# Altium project PDC.PrjPCB (part 1 of 2)
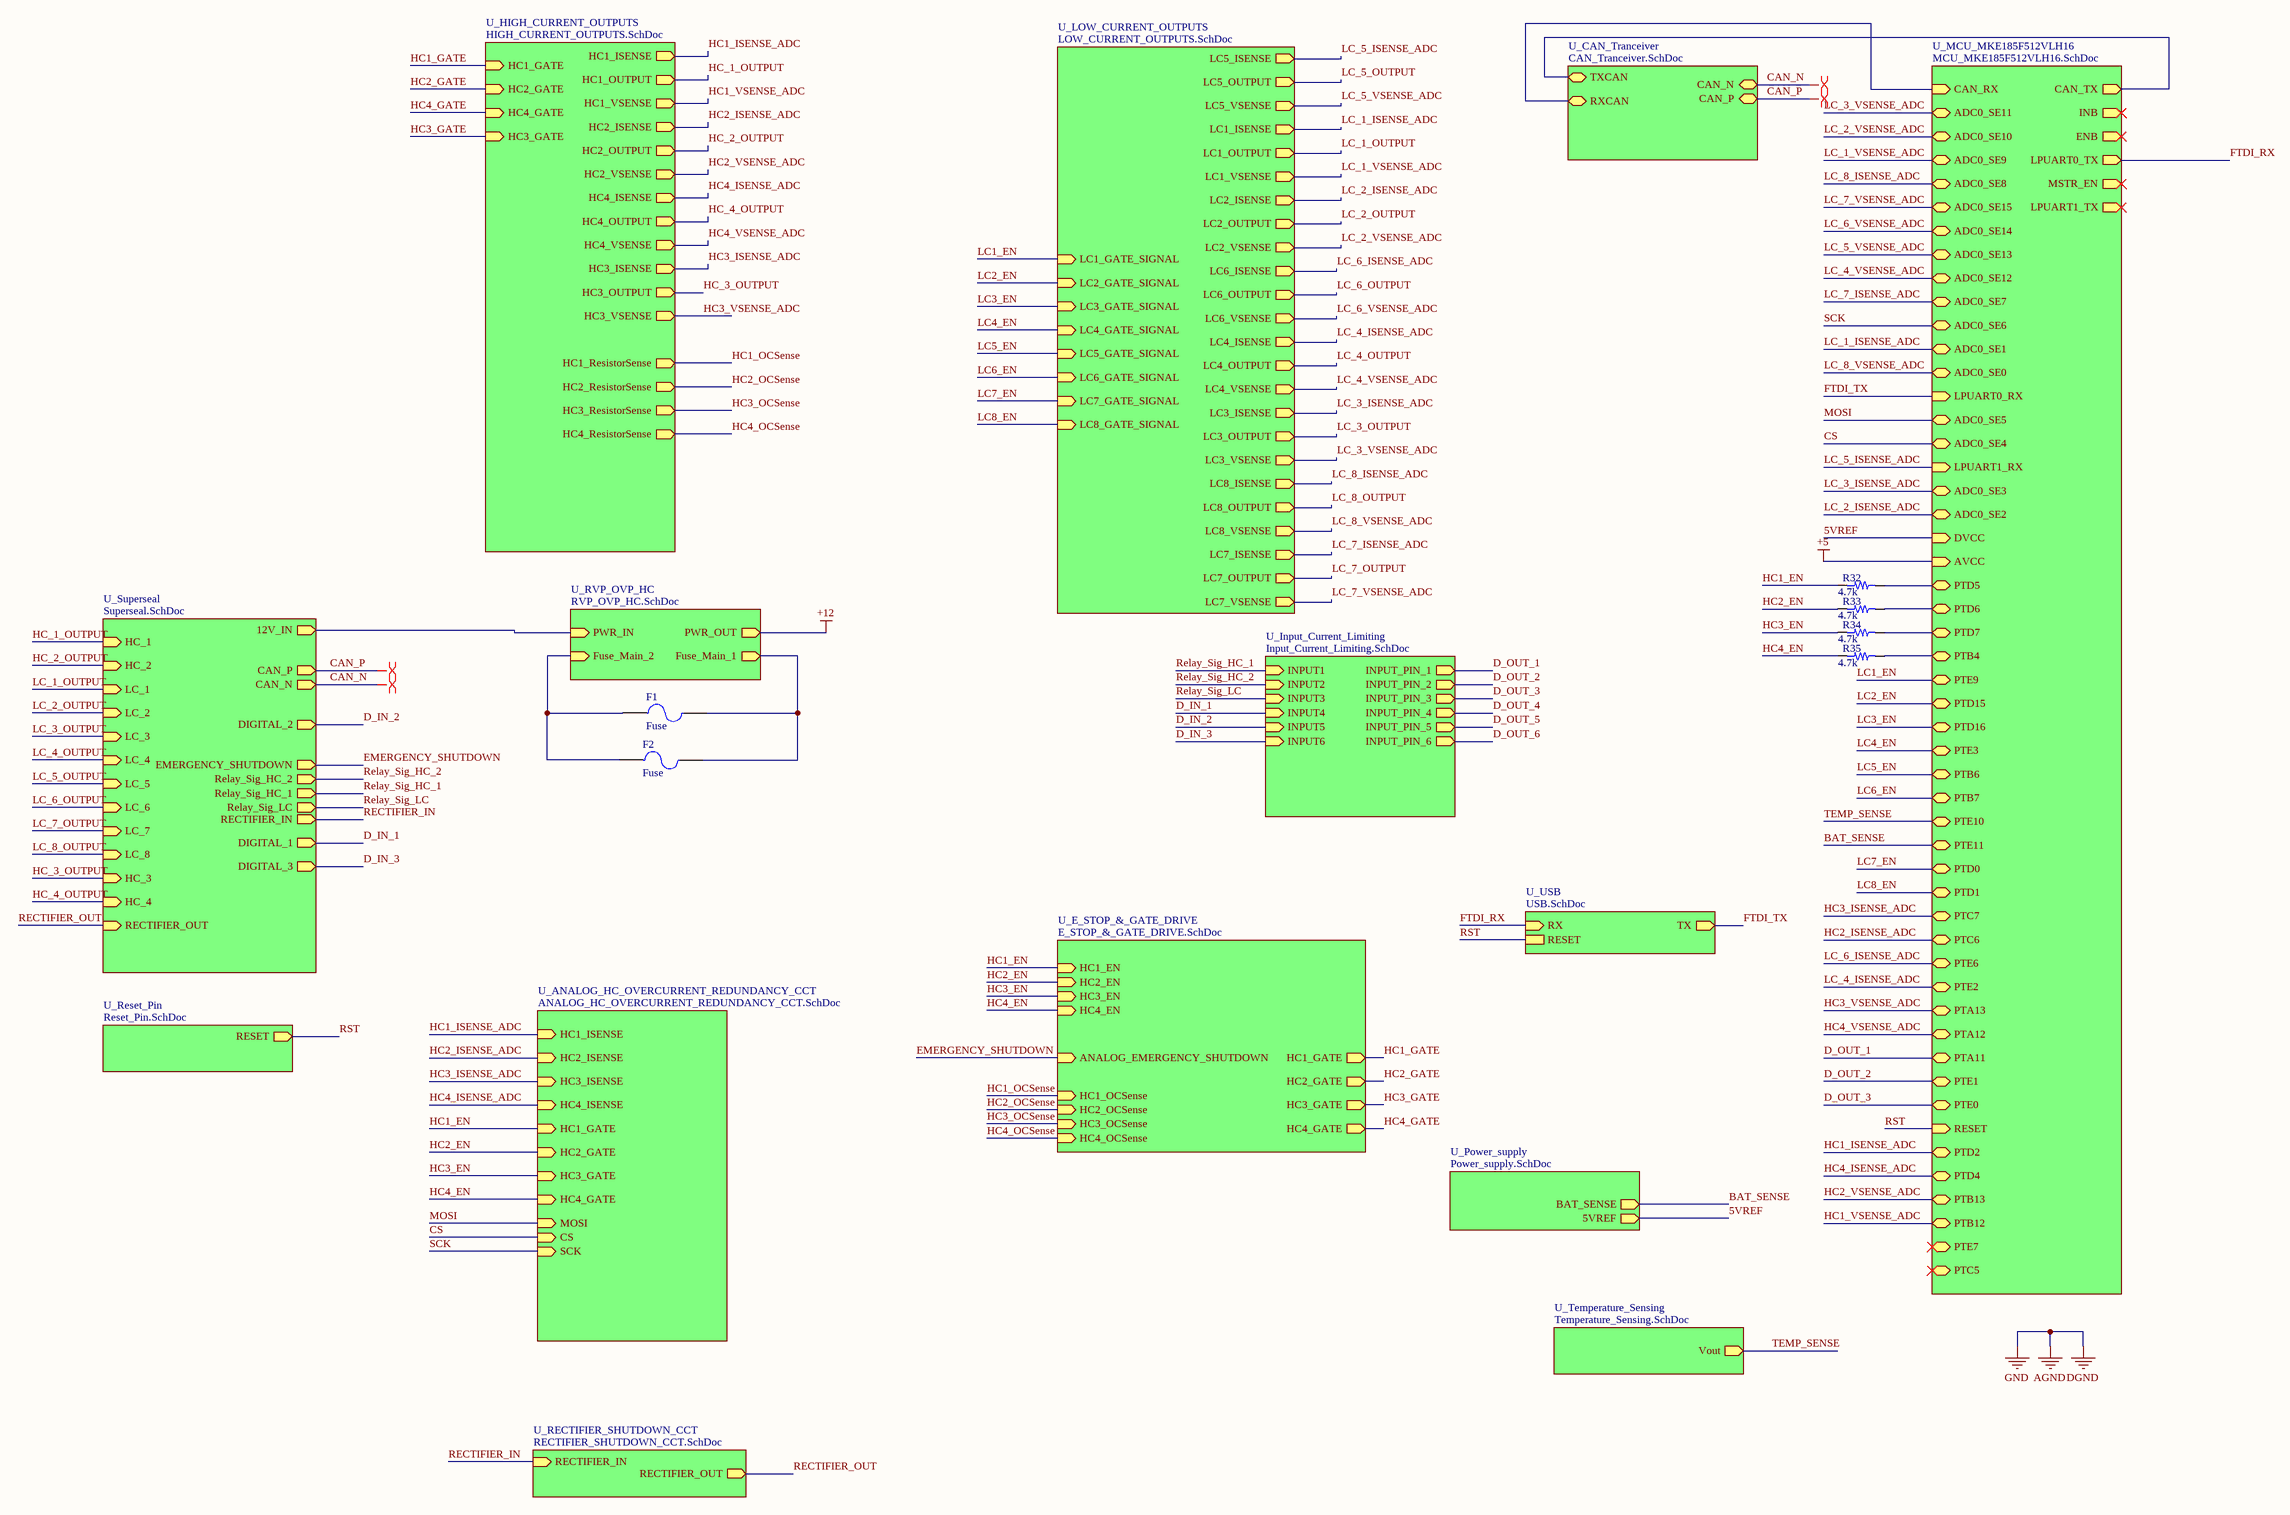
[diagram p0: PDC.SchDoc]
20 sheets, 149 parts. Net scope: hierarchical (ports join the sheet entries above them; power ports are global).
Board file: PDC_Rev2.PcbDoc
Sheets:
  PDC.SchDoc
    U_Superseal = Superseal.SchDoc
    U_LOW_CURRENT_OUTPUTS = LOW_CURRENT_OUTPUTS.SchDoc
      U_PDC_Low_Current_Outputs = PDC_Low_Current_Outputs.SchDoc
      U_PDC_Low_Current_Outputs = PDC_Low_Current_Outputs.SchDoc
      U_PDC_Low_Current_Outputs = PDC_Low_Current_Outputs.SchDoc
      U_PDC_Low_Current_Outputs = PDC_Low_Current_Outputs.SchDoc
      U_PDC_Low_Current_Outputs = PDC_Low_Current_Outputs.SchDoc
      U_PDC_Low_Current_Outputs = PDC_Low_Current_Outputs.SchDoc
      U_PDC_Low_Current_Outputs = PDC_Low_Current_Outputs.SchDoc
      U_PDC_Low_Current_Outputs = PDC_Low_Current_Outputs.SchDoc
      U_PDC_Gate_Driver = PDC_Gate_Driver.SchDoc
      U_PDC_Gate_Driver = PDC_Gate_Driver.SchDoc
    U_E_STOP_&_GATE_DRIVE = E_STOP_&_GATE_DRIVE.SchDoc
      U_Gate_driver = Gate_driver.SchDoc
      U_E_stop = E_stop.SchDoc
    U_Reset_Pin = Reset_Pin.SchDoc
    U_Temperature_Sensing = Temperature_Sensing.SchDoc
    U_RECTIFIER_SHUTDOWN_CCT = RECTIFIER_SHUTDOWN_CCT.SchDoc
      U_Rectifier_shutdown_Gate = Rectifier_shutdown_Gate.SchDoc
      U_Rectifier_shutdown_LT1910 = Rectifier_shutdown_LT1910.SchDoc
    U_HIGH_CURRENT_OUTPUTS = HIGH_CURRENT_OUTPUTS.SchDoc
      U_PDC_high_Current_Outputs = PDC_high_Current_Outputs.SchDoc
      U_PDC_high_Current_Outputs = PDC_high_Current_Outputs.SchDoc
      U_PDC_high_Current_Outputs = PDC_high_Current_Outputs.SchDoc
      U_PDC_high_Current_Outputs = PDC_high_Current_Outputs.SchDoc
    U_ANALOG_HC_OVERCURRENT_REDUNDANCY_CCT = ANALOG_HC_OVERCURRENT_REDUNDANCY_CCT.SchDoc
      U_Analog_HC_Overcurrent_Redundancy = Analog_HC_Overcurrent_Redundancy.SchDoc
      U_Analog_HC_Overcurrent_Redundancy = Analog_HC_Overcurrent_Redundancy.SchDoc
      U_Analog_HC_Overcurrent_Redundancy = Analog_HC_Overcurrent_Redundancy.SchDoc
      U_Analog_HC_Overcurrent_Redundancy = Analog_HC_Overcurrent_Redundancy.SchDoc
      U_Analog_HC_Overcurrent_MMPQ3904 = Analog_HC_Overcurrent_MMPQ3904.SchDoc
    U_Power_supply = Power_supply.SchDoc
    U_Input_Current_Limiting = Input_Current_Limiting.SchDoc

## Sheet PDC.SchDoc
size C

### Parts
F1  Fuse  [3568-MiniFuseHolder]
F2  Fuse  [3568-MiniFuseHolder]
R32  4.7k  [RES 0603/1608]
R33  4.7k  [RES 0603/1608]
R34  4.7k  [RES 0603/1608]
R35  4.7k  [RES 0603/1608]

### Sub-sheets
U_ANALOG_HC_OVERCURRENT_REDUNDANCY_CCT = ANALOG_HC_OVERCURRENT_REDUNDANCY_CCT.SchDoc: HC1_ISENSE (in), HC2_ISENSE (in), HC3_ISENSE (in), HC4_ISENSE (in), HC1_GATE (in), HC2_GATE (in), HC3_GATE (in), HC4_GATE (in), MOSI (in), CS (in), SCK (in)
U_CAN_Tranceiver = CAN_Tranceiver.SchDoc (file not in this document): TXCAN (bidir), RXCAN (bidir), CAN_N (bidir), CAN_P (bidir)
U_E_STOP_&_GATE_DRIVE = E_STOP_&_GATE_DRIVE.SchDoc: HC1_GATE (out), HC2_GATE (out), HC3_GATE (out), HC4_GATE (out), HC1_EN (in), HC4_EN (in), HC3_EN (in), HC2_EN (in), ANALOG_EMERGENCY_SHUTDOWN (in), HC1_OCSense (in), HC2_OCSense (in), HC4_OCSense (in), HC3_OCSense (in)
U_HIGH_CURRENT_OUTPUTS = HIGH_CURRENT_OUTPUTS.SchDoc: HC1_GATE (in), HC1_ISENSE (out), HC1_OUTPUT (out), HC1_VSENSE (out), HC2_GATE (in), HC2_ISENSE (out), HC2_OUTPUT (out), HC2_VSENSE (out), HC4_GATE (in), HC4_ISENSE (out), HC4_OUTPUT (out), HC4_VSENSE (out), HC3_GATE (in), HC3_ISENSE (out), HC3_OUTPUT (out), HC3_VSENSE (out), HC3_ResistorSense (out), HC4_ResistorSense (out), HC2_ResistorSense (out), HC1_ResistorSense (out)
U_Input_Current_Limiting = Input_Current_Limiting.SchDoc: INPUT_PIN_1 (out), INPUT_PIN_2 (out), INPUT1 (in), INPUT2 (in), INPUT_PIN_3 (out), INPUT3 (in), INPUT4 (in), INPUT_PIN_4 (out), INPUT_PIN_5 (out), INPUT5 (in), INPUT6 (in), INPUT_PIN_6 (out)
U_LOW_CURRENT_OUTPUTS = LOW_CURRENT_OUTPUTS.SchDoc: LC5_ISENSE (out), LC5_OUTPUT (out), LC5_VSENSE (out), LC1_ISENSE (out), LC1_OUTPUT (out), LC1_VSENSE (out), LC2_ISENSE (out), LC2_OUTPUT (out), LC2_VSENSE (out), LC6_ISENSE (out), LC6_OUTPUT (out), LC6_VSENSE (out), LC4_ISENSE (out), LC4_OUTPUT (out), LC4_VSENSE (out), LC3_ISENSE (out), LC3_OUTPUT (out), LC3_VSENSE (out), LC8_ISENSE (out), LC8_OUTPUT (out), LC8_VSENSE (out), LC7_ISENSE (out), LC7_OUTPUT (out), LC7_VSENSE (out), LC1_GATE_SIGNAL (in), LC2_GATE_SIGNAL (in), LC3_GATE_SIGNAL (in), LC4_GATE_SIGNAL (in), LC5_GATE_SIGNAL (in), LC6_GATE_SIGNAL (in), LC7_GATE_SIGNAL (in), LC8_GATE_SIGNAL (in)
U_MCU_MKE185F512VLH16 = MCU_MKE185F512VLH16.SchDoc (file not in this document): CAN_TX (out), CAN_RX (in), INB (out), ENB (out), ADC0_SE11 (bidir), ADC0_SE10 (bidir), ADC0_SE9 (bidir), ADC0_SE8 (bidir), ADC0_SE15 (bidir), ADC0_SE14 (bidir), ADC0_SE13 (bidir), ADC0_SE12 (bidir), ADC0_SE7 (bidir), ADC0_SE6 (bidir), ADC0_SE1 (bidir), ADC0_SE0 (bidir), LPUART0_TX (out), LPUART0_RX (in), MSTR_EN (out), ADC0_SE5 (bidir), ADC0_SE4 (bidir), LPUART1_TX (out), LPUART1_RX (in), ADC0_SE3 (bidir), ADC0_SE2 (bidir), DVCC (in), AVCC (in), PTD5 (bidir), PTD6 (bidir), PTD7 (bidir), PTB4 (bidir), PTE9 (bidir), PTD15 (bidir), PTD16 (bidir), PTE3 (bidir), PTB6 (bidir), PTB7 (bidir), PTE10 (bidir), PTE11 (bidir), PTD0 (bidir), PTD1 (bidir), PTC7 (bidir), PTC6 (bidir), PTE6 (bidir), PTE2 (bidir), PTA13 (bidir), PTA12 (bidir), PTA11 (bidir), PTE1 (bidir), PTE0 (bidir), RESET (in), PTD2 (bidir), PTD4 (bidir), PTB13 (bidir), PTB12 (bidir), PTE7 (bidir), PTC5 (bidir)
U_Power_supply = Power_supply.SchDoc: BAT_SENSE (out), 5VREF (out)
U_RECTIFIER_SHUTDOWN_CCT = RECTIFIER_SHUTDOWN_CCT.SchDoc: RECTIFIER_IN (in), RECTIFIER_OUT (out)
U_Reset_Pin = Reset_Pin.SchDoc: RESET (out)
U_RVP_OVP_HC = RVP_OVP_HC.SchDoc (file not in this document): PWR_IN (in), PWR_OUT (out), Fuse_Main_1 (out), Fuse_Main_2 (in)
U_Superseal = Superseal.SchDoc: 12V_IN (out), HC_1 (in), HC_2 (in), LC_1 (in), LC_2 (in), LC_3 (in), LC_4 (in), LC_5 (in), LC_6 (in), LC_7 (in), LC_8 (in), HC_3 (in), HC_4 (in), DIGITAL_2 (out), RECTIFIER_OUT (in), RECTIFIER_IN (out), DIGITAL_1 (out), DIGITAL_3 (out), EMERGENCY_SHUTDOWN (out), Relay_Sig_HC_2 (out), Relay_Sig_HC_1 (out), Relay_Sig_LC (out), CAN_P (out), CAN_N (out)
U_Temperature_Sensing = Temperature_Sensing.SchDoc: Vout (out)
U_USB = USB.SchDoc (file not in this document): TX (out), RX (in), RESET

### Nets
5VREF: sheet U_MCU_MKE185F512VLH16/DVCC, sheet U_Power_supply/5VREF
12V_IN: sheet U_Superseal/12V_IN, sheet U_RVP_OVP_HC/PWR_IN
BAT_SENSE: sheet U_MCU_MKE185F512VLH16/PTE11, sheet U_Power_supply/BAT_SENSE
CAN_N: sheet U_Superseal/CAN_N, sheet U_CAN_Tranceiver/CAN_N
CAN_P: sheet U_Superseal/CAN_P, sheet U_CAN_Tranceiver/CAN_P
CS: sheet U_MCU_MKE185F512VLH16/ADC0_SE4, sheet U_ANALOG_HC_OVERCURRENT_REDUNDANCY_CCT/CS
D_IN_1: sheet U_Superseal/DIGITAL_1, sheet U_Input_Current_Limiting/INPUT4
D_IN_2: sheet U_Superseal/DIGITAL_2, sheet U_Input_Current_Limiting/INPUT5
D_IN_3: sheet U_Superseal/DIGITAL_3, sheet U_Input_Current_Limiting/INPUT6
D_OUT_1: sheet U_MCU_MKE185F512VLH16/PTA11, sheet U_Input_Current_Limiting/INPUT_PIN_1
D_OUT_2: sheet U_MCU_MKE185F512VLH16/PTE1, sheet U_Input_Current_Limiting/INPUT_PIN_2
D_OUT_3: sheet U_MCU_MKE185F512VLH16/PTE0, sheet U_Input_Current_Limiting/INPUT_PIN_3
EMERGENCY_SHUTDOWN: sheet U_Superseal/EMERGENCY_SHUTDOWN, sheet U_E_STOP_&_GATE_DRIVE/ANALOG_EMERGENCY_SHUTDOWN
FTDI_RX: sheet U_MCU_MKE185F512VLH16/LPUART0_TX, sheet U_USB/RX
FTDI_TX: sheet U_MCU_MKE185F512VLH16/LPUART0_RX, sheet U_USB/TX
HC1_EN: R32.1 ; sheet U_E_STOP_&_GATE_DRIVE/HC1_EN, sheet U_ANALOG_HC_OVERCURRENT_REDUNDANCY_CCT/HC1_GATE
HC1_GATE: sheet U_E_STOP_&_GATE_DRIVE/HC1_GATE, sheet U_HIGH_CURRENT_OUTPUTS/HC1_GATE
HC1_ISENSE_ADC: sheet U_MCU_MKE185F512VLH16/PTD2, sheet U_HIGH_CURRENT_OUTPUTS/HC1_ISENSE, sheet U_ANALOG_HC_OVERCURRENT_REDUNDANCY_CCT/HC1_ISENSE
HC1_OCSense: sheet U_E_STOP_&_GATE_DRIVE/HC1_OCSense, sheet U_HIGH_CURRENT_OUTPUTS/HC1_ResistorSense
HC1_VSENSE_ADC: sheet U_MCU_MKE185F512VLH16/PTB12, sheet U_HIGH_CURRENT_OUTPUTS/HC1_VSENSE
HC2_EN: R33.1 ; sheet U_E_STOP_&_GATE_DRIVE/HC2_EN, sheet U_ANALOG_HC_OVERCURRENT_REDUNDANCY_CCT/HC2_GATE
HC2_GATE: sheet U_E_STOP_&_GATE_DRIVE/HC2_GATE, sheet U_HIGH_CURRENT_OUTPUTS/HC2_GATE
HC2_ISENSE_ADC: sheet U_MCU_MKE185F512VLH16/PTC6, sheet U_HIGH_CURRENT_OUTPUTS/HC2_ISENSE, sheet U_ANALOG_HC_OVERCURRENT_REDUNDANCY_CCT/HC2_ISENSE
HC2_OCSense: sheet U_E_STOP_&_GATE_DRIVE/HC2_OCSense, sheet U_HIGH_CURRENT_OUTPUTS/HC2_ResistorSense
HC2_VSENSE_ADC: sheet U_MCU_MKE185F512VLH16/PTB13, sheet U_HIGH_CURRENT_OUTPUTS/HC2_VSENSE
HC3_EN: R34.1 ; sheet U_E_STOP_&_GATE_DRIVE/HC3_EN, sheet U_ANALOG_HC_OVERCURRENT_REDUNDANCY_CCT/HC3_GATE
HC3_GATE: sheet U_E_STOP_&_GATE_DRIVE/HC3_GATE, sheet U_HIGH_CURRENT_OUTPUTS/HC3_GATE
HC3_ISENSE_ADC: sheet U_MCU_MKE185F512VLH16/PTC7, sheet U_HIGH_CURRENT_OUTPUTS/HC3_ISENSE, sheet U_ANALOG_HC_OVERCURRENT_REDUNDANCY_CCT/HC3_ISENSE
HC3_OCSense: sheet U_E_STOP_&_GATE_DRIVE/HC3_OCSense, sheet U_HIGH_CURRENT_OUTPUTS/HC3_ResistorSense
HC3_VSENSE_ADC: sheet U_MCU_MKE185F512VLH16/PTA13, sheet U_HIGH_CURRENT_OUTPUTS/HC3_VSENSE
HC4_EN: R35.1 ; sheet U_E_STOP_&_GATE_DRIVE/HC4_EN, sheet U_ANALOG_HC_OVERCURRENT_REDUNDANCY_CCT/HC4_GATE
HC4_GATE: sheet U_E_STOP_&_GATE_DRIVE/HC4_GATE, sheet U_HIGH_CURRENT_OUTPUTS/HC4_GATE
HC4_ISENSE_ADC: sheet U_MCU_MKE185F512VLH16/PTD4, sheet U_HIGH_CURRENT_OUTPUTS/HC4_ISENSE, sheet U_ANALOG_HC_OVERCURRENT_REDUNDANCY_CCT/HC4_ISENSE
HC4_OCSense: sheet U_E_STOP_&_GATE_DRIVE/HC4_OCSense, sheet U_HIGH_CURRENT_OUTPUTS/HC4_ResistorSense
HC4_VSENSE_ADC: sheet U_MCU_MKE185F512VLH16/PTA12, sheet U_HIGH_CURRENT_OUTPUTS/HC4_VSENSE
HC_1_OUTPUT: sheet U_Superseal/HC_1, sheet U_HIGH_CURRENT_OUTPUTS/HC1_OUTPUT
HC_2_OUTPUT: sheet U_Superseal/HC_2, sheet U_HIGH_CURRENT_OUTPUTS/HC2_OUTPUT
HC_3_OUTPUT: sheet U_Superseal/HC_3, sheet U_HIGH_CURRENT_OUTPUTS/HC3_OUTPUT
HC_4_OUTPUT: sheet U_Superseal/HC_4, sheet U_HIGH_CURRENT_OUTPUTS/HC4_OUTPUT
LC1_EN: sheet U_LOW_CURRENT_OUTPUTS/LC1_GATE_SIGNAL, sheet U_MCU_MKE185F512VLH16/PTE9
LC2_EN: sheet U_LOW_CURRENT_OUTPUTS/LC2_GATE_SIGNAL, sheet U_MCU_MKE185F512VLH16/PTD15
LC3_EN: sheet U_LOW_CURRENT_OUTPUTS/LC3_GATE_SIGNAL, sheet U_MCU_MKE185F512VLH16/PTD16
LC4_EN: sheet U_LOW_CURRENT_OUTPUTS/LC4_GATE_SIGNAL, sheet U_MCU_MKE185F512VLH16/PTE3
LC5_EN: sheet U_LOW_CURRENT_OUTPUTS/LC5_GATE_SIGNAL, sheet U_MCU_MKE185F512VLH16/PTB6
LC6_EN: sheet U_LOW_CURRENT_OUTPUTS/LC6_GATE_SIGNAL, sheet U_MCU_MKE185F512VLH16/PTB7
LC7_EN: sheet U_LOW_CURRENT_OUTPUTS/LC7_GATE_SIGNAL, sheet U_MCU_MKE185F512VLH16/PTD0
LC8_EN: sheet U_LOW_CURRENT_OUTPUTS/LC8_GATE_SIGNAL, sheet U_MCU_MKE185F512VLH16/PTD1
LC_1_ISENSE_ADC: sheet U_LOW_CURRENT_OUTPUTS/LC1_ISENSE, sheet U_MCU_MKE185F512VLH16/ADC0_SE1
LC_1_OUTPUT: sheet U_Superseal/LC_1, sheet U_LOW_CURRENT_OUTPUTS/LC1_OUTPUT
LC_1_VSENSE_ADC: sheet U_LOW_CURRENT_OUTPUTS/LC1_VSENSE, sheet U_MCU_MKE185F512VLH16/ADC0_SE9
LC_2_ISENSE_ADC: sheet U_LOW_CURRENT_OUTPUTS/LC2_ISENSE, sheet U_MCU_MKE185F512VLH16/ADC0_SE2
LC_2_OUTPUT: sheet U_Superseal/LC_2, sheet U_LOW_CURRENT_OUTPUTS/LC2_OUTPUT
LC_2_VSENSE_ADC: sheet U_LOW_CURRENT_OUTPUTS/LC2_VSENSE, sheet U_MCU_MKE185F512VLH16/ADC0_SE10
LC_3_ISENSE_ADC: sheet U_LOW_CURRENT_OUTPUTS/LC3_ISENSE, sheet U_MCU_MKE185F512VLH16/ADC0_SE3
LC_3_OUTPUT: sheet U_Superseal/LC_3, sheet U_LOW_CURRENT_OUTPUTS/LC3_OUTPUT
LC_3_VSENSE_ADC: sheet U_LOW_CURRENT_OUTPUTS/LC3_VSENSE, sheet U_MCU_MKE185F512VLH16/ADC0_SE11
LC_4_ISENSE_ADC: sheet U_LOW_CURRENT_OUTPUTS/LC4_ISENSE, sheet U_MCU_MKE185F512VLH16/PTE2
LC_4_OUTPUT: sheet U_Superseal/LC_4, sheet U_LOW_CURRENT_OUTPUTS/LC4_OUTPUT
LC_4_VSENSE_ADC: sheet U_LOW_CURRENT_OUTPUTS/LC4_VSENSE, sheet U_MCU_MKE185F512VLH16/ADC0_SE12
LC_5_ISENSE_ADC: sheet U_LOW_CURRENT_OUTPUTS/LC5_ISENSE, sheet U_MCU_MKE185F512VLH16/LPUART1_RX
LC_5_OUTPUT: sheet U_Superseal/LC_5, sheet U_LOW_CURRENT_OUTPUTS/LC5_OUTPUT
LC_5_VSENSE_ADC: sheet U_LOW_CURRENT_OUTPUTS/LC5_VSENSE, sheet U_MCU_MKE185F512VLH16/ADC0_SE13
LC_6_ISENSE_ADC: sheet U_LOW_CURRENT_OUTPUTS/LC6_ISENSE, sheet U_MCU_MKE185F512VLH16/PTE6
LC_6_OUTPUT: sheet U_Superseal/LC_6, sheet U_LOW_CURRENT_OUTPUTS/LC6_OUTPUT
LC_6_VSENSE_ADC: sheet U_LOW_CURRENT_OUTPUTS/LC6_VSENSE, sheet U_MCU_MKE185F512VLH16/ADC0_SE14
LC_7_ISENSE_ADC: sheet U_LOW_CURRENT_OUTPUTS/LC7_ISENSE, sheet U_MCU_MKE185F512VLH16/ADC0_SE7
LC_7_OUTPUT: sheet U_Superseal/LC_7, sheet U_LOW_CURRENT_OUTPUTS/LC7_OUTPUT
LC_7_VSENSE_ADC: sheet U_LOW_CURRENT_OUTPUTS/LC7_VSENSE, sheet U_MCU_MKE185F512VLH16/ADC0_SE15
LC_8_ISENSE_ADC: sheet U_LOW_CURRENT_OUTPUTS/LC8_ISENSE, sheet U_MCU_MKE185F512VLH16/ADC0_SE8
LC_8_OUTPUT: sheet U_Superseal/LC_8, sheet U_LOW_CURRENT_OUTPUTS/LC8_OUTPUT
LC_8_VSENSE_ADC: sheet U_LOW_CURRENT_OUTPUTS/LC8_VSENSE, sheet U_MCU_MKE185F512VLH16/ADC0_SE0
MOSI: sheet U_MCU_MKE185F512VLH16/ADC0_SE5, sheet U_ANALOG_HC_OVERCURRENT_REDUNDANCY_CCT/MOSI
RECTIFIER_IN: sheet U_Superseal/RECTIFIER_IN, sheet U_RECTIFIER_SHUTDOWN_CCT/RECTIFIER_IN
RECTIFIER_OUT: sheet U_Superseal/RECTIFIER_OUT, sheet U_RECTIFIER_SHUTDOWN_CCT/RECTIFIER_OUT
Relay_Sig_HC_1: sheet U_Superseal/Relay_Sig_HC_1, sheet U_Input_Current_Limiting/INPUT1
Relay_Sig_HC_2: sheet U_Superseal/Relay_Sig_HC_2, sheet U_Input_Current_Limiting/INPUT2
Relay_Sig_LC: sheet U_Superseal/Relay_Sig_LC, sheet U_Input_Current_Limiting/INPUT3
RST: sheet U_Reset_Pin/RESET, sheet U_MCU_MKE185F512VLH16/RESET, sheet U_USB/RESET
SCK: sheet U_MCU_MKE185F512VLH16/ADC0_SE6, sheet U_ANALOG_HC_OVERCURRENT_REDUNDANCY_CCT/SCK
TEMP_SENSE: sheet U_Temperature_Sensing/Vout, sheet U_MCU_MKE185F512VLH16/PTE10
NetF1_1: F1.1 F2.1 ; sheet U_RVP_OVP_HC/Fuse_Main_2
NetF1_2: F1.2 F2.2 ; sheet U_RVP_OVP_HC/Fuse_Main_1
NetR32_2: R32.2 ; sheet U_MCU_MKE185F512VLH16/PTD5
NetR33_2: R33.2 ; sheet U_MCU_MKE185F512VLH16/PTD6
NetR34_2: R34.2 ; sheet U_MCU_MKE185F512VLH16/PTD7
NetR35_2: R35.2 ; sheet U_MCU_MKE185F512VLH16/PTB4
(unnamed): sheet U_CAN_Tranceiver/TXCAN, sheet U_MCU_MKE185F512VLH16/CAN_TX
(unnamed): sheet U_CAN_Tranceiver/RXCAN, sheet U_MCU_MKE185F512VLH16/CAN_RX

### Layout directives
differential pair: CAN_N, CAN_P

### Library data of the parts
F1 F2 = 3: Manufacturer_id: 1; idFuse: 3; Name: 3568 Mini Fuse Holder; Drawer_id: 1
R32-R35 = 1: id: 1; name: 0603 Resistor; percent tolerance: 5; resistance: 4.7k; package: 0603; quantity: 0

## Sheet Superseal.SchDoc
size A
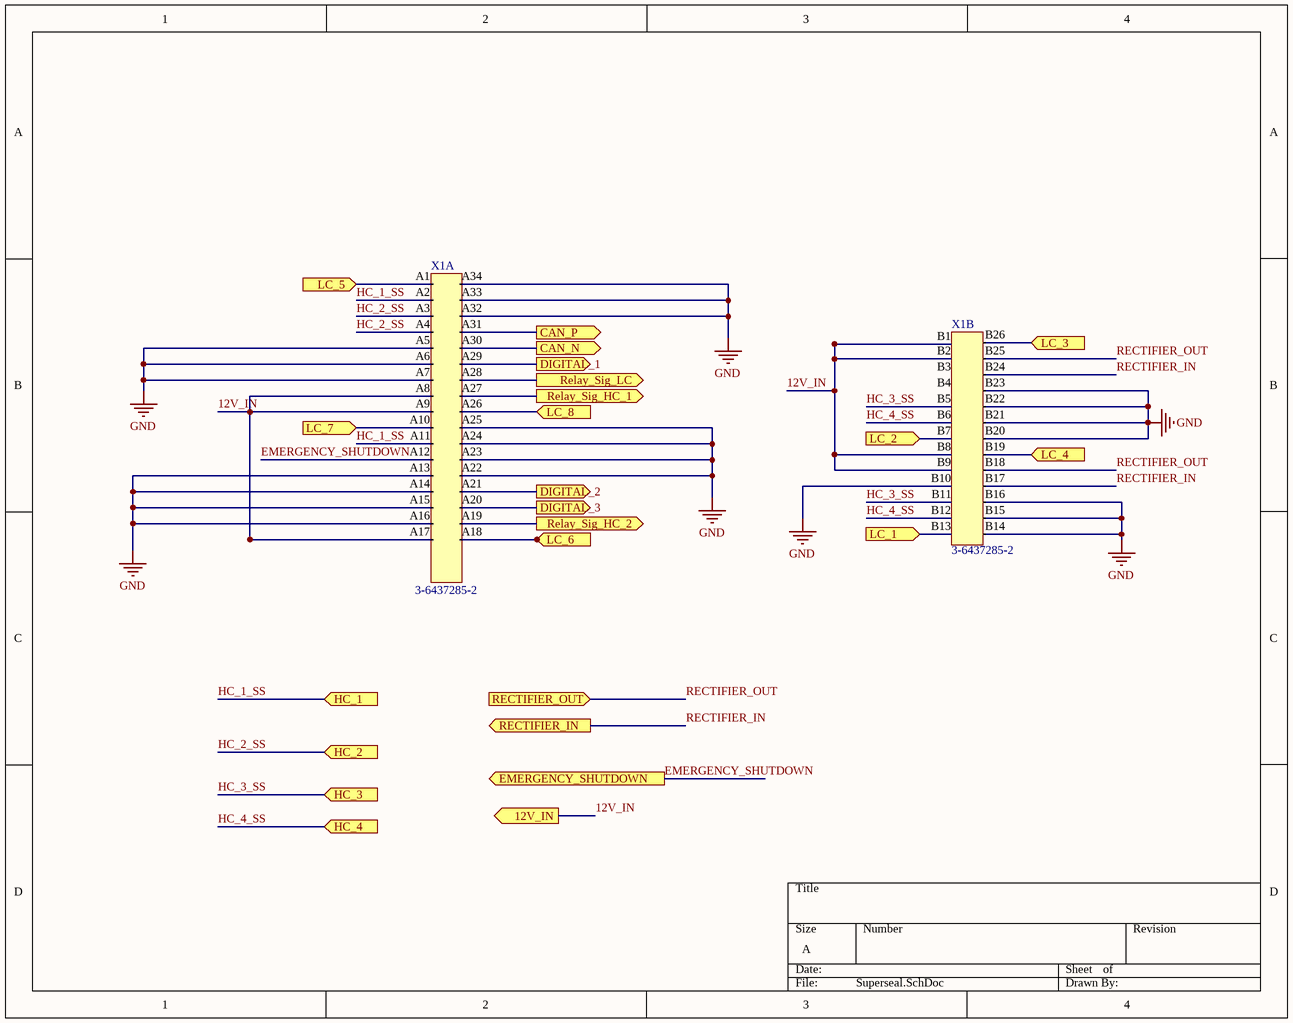
[diagram p1: Superseal.SchDoc]

### Parts
X1  3-6437285-2  [SUPERSEAL 60POS 90Deg]  (parts A,B of 2)

### Ports
12V_IN (out), CAN_N (out), CAN_P (out), DIGITAL_1 (out), DIGITAL_2 (out), DIGITAL_3 (out), EMERGENCY_SHUTDOWN (out), HC_1 (in), HC_2 (in), HC_3 (in), HC_4 (in), LC_1 (in), LC_2 (in), LC_3 (in), LC_4 (in), LC_5 (in), LC_6 (in), LC_7 (in), LC_8 (in), RECTIFIER_IN (out), RECTIFIER_OUT (in), Relay_Sig_HC_1 (out), Relay_Sig_HC_2 (out), Relay_Sig_LC (out)

### Nets
GND: X1.A5 X1.A6 X1.A7 X1.A13 X1.A14 X1.A15 X1.A16 X1.A22 X1.A23 X1.A24 X1.A25 X1.A32 X1.A33 X1.A34 X1.B10 X1.B14 X1.B15 X1.B16 X1.B20 X1.B21 X1.B22 X1.B23  [project net AGND]
12V_IN: X1.A8 X1.A9 X1.A17 X1.B1 X1.B2 X1.B8 X1.B9 ; port 12V_IN
CAN_N: X1.A30 ; port CAN_N
CAN_P: X1.A31 ; port CAN_P
D_IN_1: X1.A29 ; port DIGITAL_1
D_IN_2: X1.A21 ; port DIGITAL_2
D_IN_3: X1.A20 ; port DIGITAL_3
EMERGENCY_SHUTDOWN: X1.A12 ; port EMERGENCY_SHUTDOWN
HC_1_SS: X1.A2 X1.A11 ; port HC_1  [project net HC_1_OUTPUT]
HC_2_SS: X1.A3 X1.A4 ; port HC_2  [project net HC_2_OUTPUT]
HC_3_SS: X1.B5 X1.B11 ; port HC_3  [project net HC_3_OUTPUT]
HC_4_SS: X1.B6 X1.B12 ; port HC_4  [project net HC_4_OUTPUT]
LC_1_OUTPUT: X1.B13 ; port LC_1
LC_2_OUTPUT: X1.B7 ; port LC_2
LC_3_OUTPUT: X1.B26 ; port LC_3
LC_4_OUTPUT: X1.B19 ; port LC_4
LC_5_OUTPUT: X1.A1 ; port LC_5
LC_6_OUTPUT: X1.A18 ; port LC_6
LC_7_OUTPUT: X1.A10 ; port LC_7
LC_8_OUTPUT: X1.A26 ; port LC_8
RECTIFIER_IN: X1.B17 X1.B24 ; port RECTIFIER_IN
RECTIFIER_OUT: X1.B18 X1.B25 ; port RECTIFIER_OUT
Relay_Sig_HC_1: X1.A27 ; port Relay_Sig_HC_1
Relay_Sig_HC_2: X1.A19 ; port Relay_Sig_HC_2
Relay_Sig_LC: X1.A28 ; port Relay_Sig_LC

Not connected (* = marked no-connect by the designer): X1 B3 B4

### Library data of the parts
X1 = 3: 90 Degree; Manufacturer_id: 1; idConn: 3; Name: AMP Superseal 60POS 90Deg; Value: CONN; Num_Contacts: 60; Num_Rows: 4; Pitch: 3 mm; MfrPartNo: 3-6437285-2; Drawer_id: 1; Link: https://www.te.com/usa-en/product-3-6437285-2.html; ComponentLink1Description: Datasheet

## Sheet LOW_CURRENT_OUTPUTS.SchDoc
size A
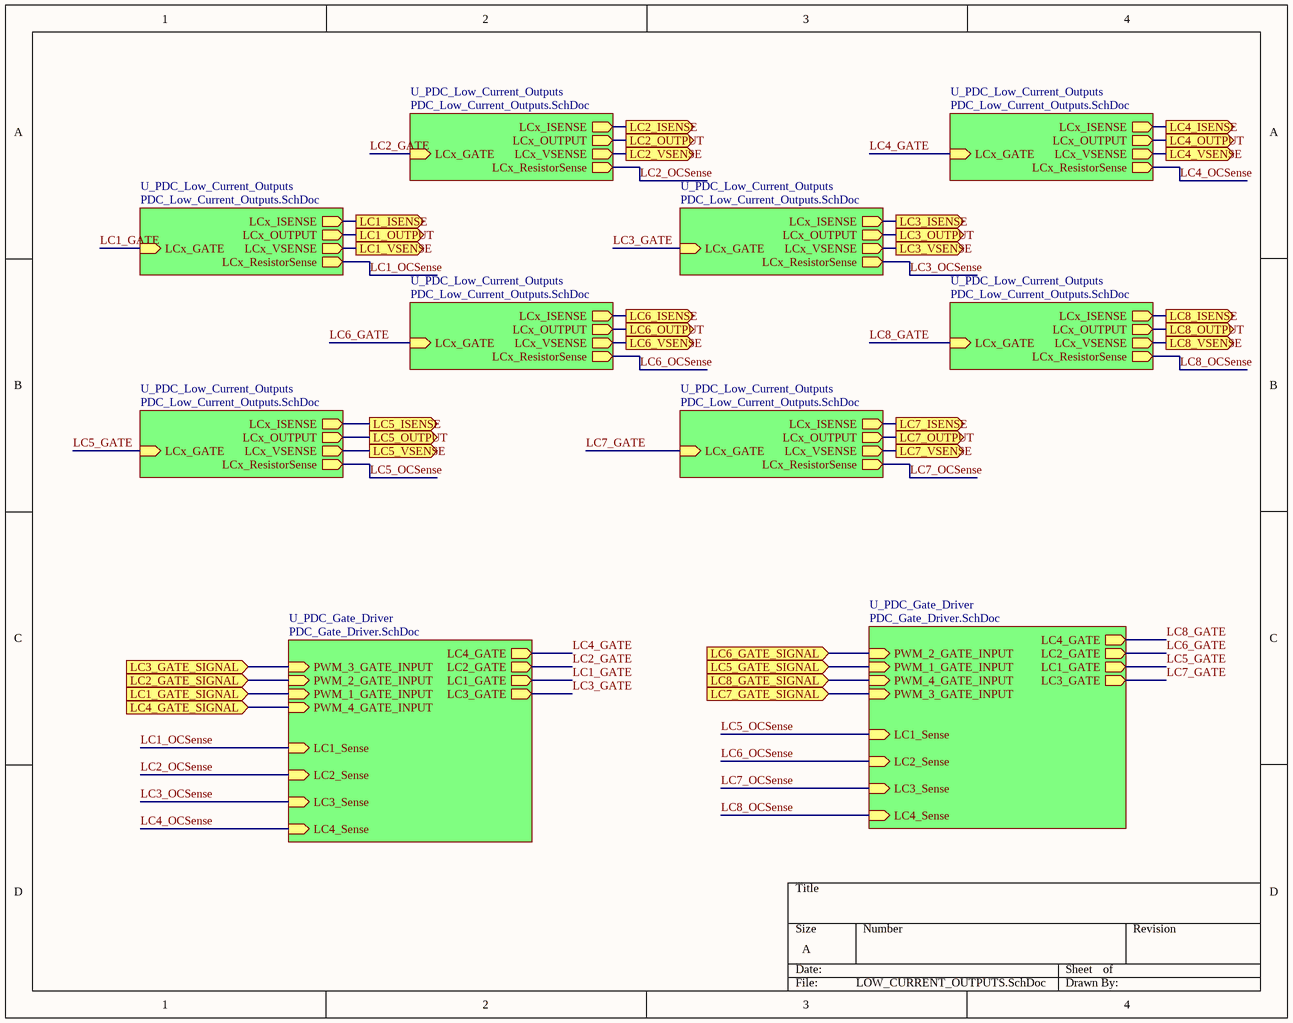
[diagram p2: LOW_CURRENT_OUTPUTS.SchDoc]

### Sub-sheets
U_PDC_Gate_Driver = PDC_Gate_Driver.SchDoc: LC4_GATE (out), LC2_GATE (out), LC1_GATE (out), LC3_GATE (out), PWM_3_GATE_INPUT (in), PWM_2_GATE_INPUT (in), PWM_1_GATE_INPUT (in), PWM_4_GATE_INPUT (in), LC4_Sense (in), LC2_Sense (in), LC1_Sense (in), LC3_Sense (in)
U_PDC_Gate_Driver = PDC_Gate_Driver.SchDoc: LC4_GATE (out), LC2_GATE (out), LC1_GATE (out), LC3_GATE (out), PWM_2_GATE_INPUT (in), PWM_1_GATE_INPUT (in), PWM_4_GATE_INPUT (in), PWM_3_GATE_INPUT (in), LC4_Sense (in), LC2_Sense (in), LC1_Sense (in), LC3_Sense (in)
U_PDC_Low_Current_Outputs = PDC_Low_Current_Outputs.SchDoc: LCx_ISENSE (out), LCx_OUTPUT (out), LCx_VSENSE (out), LCx_GATE (in), LCx_ResistorSense (out)
U_PDC_Low_Current_Outputs = PDC_Low_Current_Outputs.SchDoc: LCx_ISENSE (out), LCx_OUTPUT (out), LCx_VSENSE (out), LCx_GATE (in), LCx_ResistorSense (out)
U_PDC_Low_Current_Outputs = PDC_Low_Current_Outputs.SchDoc: LCx_ISENSE (out), LCx_OUTPUT (out), LCx_VSENSE (out), LCx_GATE (in), LCx_ResistorSense (out)
U_PDC_Low_Current_Outputs = PDC_Low_Current_Outputs.SchDoc: LCx_ISENSE (out), LCx_OUTPUT (out), LCx_VSENSE (out), LCx_GATE (in), LCx_ResistorSense (out)
U_PDC_Low_Current_Outputs = PDC_Low_Current_Outputs.SchDoc: LCx_ISENSE (out), LCx_OUTPUT (out), LCx_VSENSE (out), LCx_GATE (in), LCx_ResistorSense (out)
U_PDC_Low_Current_Outputs = PDC_Low_Current_Outputs.SchDoc: LCx_ISENSE (out), LCx_OUTPUT (out), LCx_VSENSE (out), LCx_GATE (in), LCx_ResistorSense (out)
U_PDC_Low_Current_Outputs = PDC_Low_Current_Outputs.SchDoc: LCx_ISENSE (out), LCx_OUTPUT (out), LCx_VSENSE (out), LCx_GATE (in), LCx_ResistorSense (out)
U_PDC_Low_Current_Outputs = PDC_Low_Current_Outputs.SchDoc: LCx_ISENSE (out), LCx_OUTPUT (out), LCx_VSENSE (out), LCx_GATE (in), LCx_ResistorSense (out)

### Ports
LC1_GATE_SIGNAL (in), LC1_ISENSE (out), LC1_OUTPUT (out), LC1_VSENSE (out), LC2_GATE_SIGNAL (in), LC2_ISENSE (out), LC2_OUTPUT (out), LC2_VSENSE (out), LC3_GATE_SIGNAL (in), LC3_ISENSE (out), LC3_OUTPUT (out), LC3_VSENSE (out), LC4_GATE_SIGNAL (in), LC4_ISENSE (out), LC4_OUTPUT (out), LC4_VSENSE (out), LC5_GATE_SIGNAL (in), LC5_ISENSE (out), LC5_OUTPUT (out), LC5_VSENSE (out), LC6_GATE_SIGNAL (in), LC6_ISENSE (out), LC6_OUTPUT (out), LC6_VSENSE (out), LC7_GATE_SIGNAL (in), LC7_ISENSE (out), LC7_OUTPUT (out), LC7_VSENSE (out), LC8_GATE_SIGNAL (in), LC8_ISENSE (out), LC8_OUTPUT (out), LC8_VSENSE (out)

### Nets
LC1_EN: port LC1_GATE_SIGNAL, sheet U_PDC_Gate_Driver/PWM_1_GATE_INPUT
LC1_GATE: sheet U_PDC_Low_Current_Outputs/LCx_GATE, sheet U_PDC_Gate_Driver/LC1_GATE
LC1_OCSense: sheet U_PDC_Low_Current_Outputs/LCx_ResistorSense, sheet U_PDC_Gate_Driver/LC1_Sense
LC2_EN: port LC2_GATE_SIGNAL, sheet U_PDC_Gate_Driver/PWM_2_GATE_INPUT
LC2_GATE: sheet U_PDC_Low_Current_Outputs/LCx_GATE, sheet U_PDC_Gate_Driver/LC2_GATE
LC2_OCSense: sheet U_PDC_Low_Current_Outputs/LCx_ResistorSense, sheet U_PDC_Gate_Driver/LC2_Sense
LC3_EN: port LC3_GATE_SIGNAL, sheet U_PDC_Gate_Driver/PWM_3_GATE_INPUT
LC3_GATE: sheet U_PDC_Low_Current_Outputs/LCx_GATE, sheet U_PDC_Gate_Driver/LC3_GATE
LC3_OCSense: sheet U_PDC_Low_Current_Outputs/LCx_ResistorSense, sheet U_PDC_Gate_Driver/LC3_Sense
LC4_EN: port LC4_GATE_SIGNAL, sheet U_PDC_Gate_Driver/PWM_4_GATE_INPUT
LC4_GATE: sheet U_PDC_Low_Current_Outputs/LCx_GATE, sheet U_PDC_Gate_Driver/LC4_GATE
LC4_OCSense: sheet U_PDC_Low_Current_Outputs/LCx_ResistorSense, sheet U_PDC_Gate_Driver/LC4_Sense
LC5_EN: port LC5_GATE_SIGNAL, sheet U_PDC_Gate_Driver/PWM_1_GATE_INPUT
LC5_GATE: sheet U_PDC_Low_Current_Outputs/LCx_GATE, sheet U_PDC_Gate_Driver/LC1_GATE
LC5_OCSense: sheet U_PDC_Low_Current_Outputs/LCx_ResistorSense, sheet U_PDC_Gate_Driver/LC1_Sense
LC6_EN: port LC6_GATE_SIGNAL, sheet U_PDC_Gate_Driver/PWM_2_GATE_INPUT
LC6_GATE: sheet U_PDC_Low_Current_Outputs/LCx_GATE, sheet U_PDC_Gate_Driver/LC2_GATE
LC6_OCSense: sheet U_PDC_Low_Current_Outputs/LCx_ResistorSense, sheet U_PDC_Gate_Driver/LC2_Sense
LC7_EN: port LC7_GATE_SIGNAL, sheet U_PDC_Gate_Driver/PWM_3_GATE_INPUT
LC7_GATE: sheet U_PDC_Low_Current_Outputs/LCx_GATE, sheet U_PDC_Gate_Driver/LC3_GATE
LC7_OCSense: sheet U_PDC_Low_Current_Outputs/LCx_ResistorSense, sheet U_PDC_Gate_Driver/LC3_Sense
LC8_EN: port LC8_GATE_SIGNAL, sheet U_PDC_Gate_Driver/PWM_4_GATE_INPUT
LC8_GATE: sheet U_PDC_Low_Current_Outputs/LCx_GATE, sheet U_PDC_Gate_Driver/LC4_GATE
LC8_OCSense: sheet U_PDC_Low_Current_Outputs/LCx_ResistorSense, sheet U_PDC_Gate_Driver/LC4_Sense
LC_1_ISENSE_ADC: port LC1_ISENSE, sheet U_PDC_Low_Current_Outputs/LCx_ISENSE
LC_1_OUTPUT: port LC1_OUTPUT, sheet U_PDC_Low_Current_Outputs/LCx_OUTPUT
LC_1_VSENSE_ADC: port LC1_VSENSE, sheet U_PDC_Low_Current_Outputs/LCx_VSENSE
LC_2_ISENSE_ADC: port LC2_ISENSE, sheet U_PDC_Low_Current_Outputs/LCx_ISENSE
LC_2_OUTPUT: port LC2_OUTPUT, sheet U_PDC_Low_Current_Outputs/LCx_OUTPUT
LC_2_VSENSE_ADC: port LC2_VSENSE, sheet U_PDC_Low_Current_Outputs/LCx_VSENSE
LC_3_ISENSE_ADC: port LC3_ISENSE, sheet U_PDC_Low_Current_Outputs/LCx_ISENSE
LC_3_OUTPUT: port LC3_OUTPUT, sheet U_PDC_Low_Current_Outputs/LCx_OUTPUT
LC_3_VSENSE_ADC: port LC3_VSENSE, sheet U_PDC_Low_Current_Outputs/LCx_VSENSE
LC_4_ISENSE_ADC: port LC4_ISENSE, sheet U_PDC_Low_Current_Outputs/LCx_ISENSE
LC_4_OUTPUT: port LC4_OUTPUT, sheet U_PDC_Low_Current_Outputs/LCx_OUTPUT
LC_4_VSENSE_ADC: port LC4_VSENSE, sheet U_PDC_Low_Current_Outputs/LCx_VSENSE
LC_5_ISENSE_ADC: port LC5_ISENSE, sheet U_PDC_Low_Current_Outputs/LCx_ISENSE
LC_5_OUTPUT: port LC5_OUTPUT, sheet U_PDC_Low_Current_Outputs/LCx_OUTPUT
LC_5_VSENSE_ADC: port LC5_VSENSE, sheet U_PDC_Low_Current_Outputs/LCx_VSENSE
LC_6_ISENSE_ADC: port LC6_ISENSE, sheet U_PDC_Low_Current_Outputs/LCx_ISENSE
LC_6_OUTPUT: port LC6_OUTPUT, sheet U_PDC_Low_Current_Outputs/LCx_OUTPUT
LC_6_VSENSE_ADC: port LC6_VSENSE, sheet U_PDC_Low_Current_Outputs/LCx_VSENSE
LC_7_ISENSE_ADC: port LC7_ISENSE, sheet U_PDC_Low_Current_Outputs/LCx_ISENSE
LC_7_OUTPUT: port LC7_OUTPUT, sheet U_PDC_Low_Current_Outputs/LCx_OUTPUT
LC_7_VSENSE_ADC: port LC7_VSENSE, sheet U_PDC_Low_Current_Outputs/LCx_VSENSE
LC_8_ISENSE_ADC: port LC8_ISENSE, sheet U_PDC_Low_Current_Outputs/LCx_ISENSE
LC_8_OUTPUT: port LC8_OUTPUT, sheet U_PDC_Low_Current_Outputs/LCx_OUTPUT
LC_8_VSENSE_ADC: port LC8_VSENSE, sheet U_PDC_Low_Current_Outputs/LCx_VSENSE

## Sheet PDC_Low_Current_Outputs.SchDoc
size A
Used 8 times, as channels U_LOW_CURRENT_OUTPUTS/U_PDC_Low_Current_Outputs, U_LOW_CURRENT_OUTPUTS/U_PDC_Low_Current_Outputs, U_LOW_CURRENT_OUTPUTS/U_PDC_Low_Current_Outputs, U_LOW_CURRENT_OUTPUTS/U_PDC_Low_Current_Outputs, U_LOW_CURRENT_OUTPUTS/U_PDC_Low_Current_Outputs, U_LOW_CURRENT_OUTPUTS/U_PDC_Low_Current_Outputs, U_LOW_CURRENT_OUTPUTS/U_PDC_Low_Current_Outputs, U_LOW_CURRENT_OUTPUTS/U_PDC_Low_Current_Outputs. Parts and nets are listed once, with the designators drawn on the sheet.
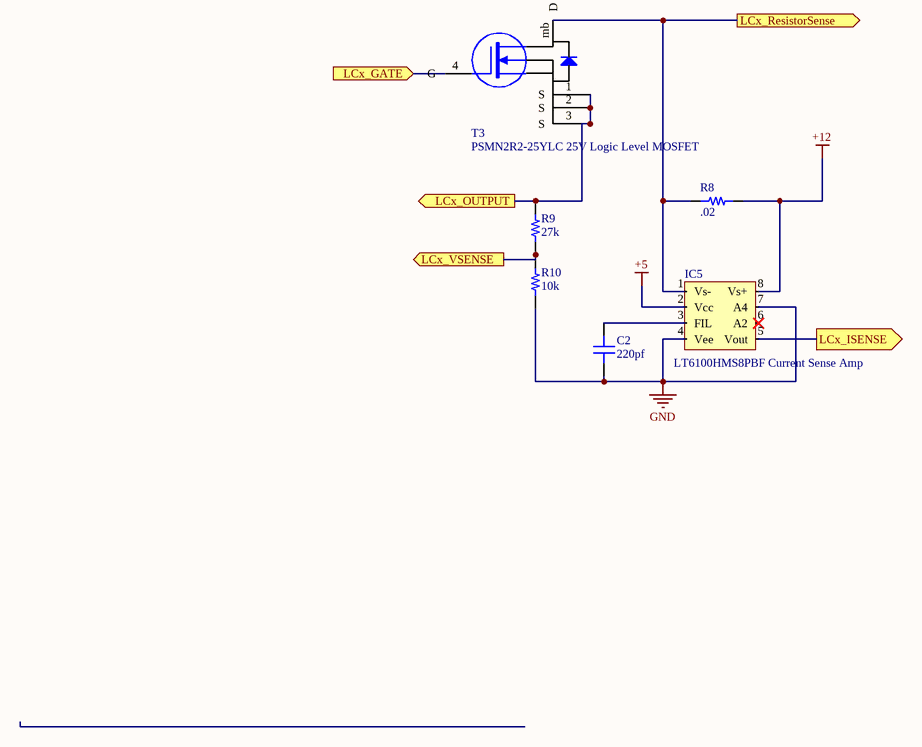
[diagram p3: PDC_Low_Current_Outputs.SchDoc]

### Parts
C2  value 220pf  [CAP 0402/1005]  (hidden comment: Capacitor MLCC 220pf 16V CAP 0402/1005)
IC5  LT6100HMS8PBF Current Sense Amp  [MSOP-8]
R8  value .02  [RES 2010/5025]  (hidden comment: Resistor .02 2010 1W 1%)
R9  value 27k  [RES 0805/2012]  (hidden comment: Resistor 27k 0805 1/10W 10%)
R10  value 10k  [RES 0402/1005]  (hidden comment: Resistor 10k 0402 1/10W 1%)
T3  PSMN2R2-25YLC 25V Logic Level MOSFET  [LFPAK-SO8]

### Ports
LCx_GATE (in), LCx_ISENSE (out), LCx_OUTPUT (out), LCx_ResistorSense (out), LCx_VSENSE (out)

### Nets
+5: IC5.2(Vcc)
+12: IC5.8(Vs+) R8.2
GND: C2.1 IC5.4(Vee) IC5.7(A4) R10.1
LCx_GATE: T3.4(G) ; port LCx_GATE
LCx_ISENSE: IC5.5(Vout) ; port LCx_ISENSE
LCx_OUTPUT: R9.2 T3.1(S) T3.2(S) T3.3(S) ; port LCx_OUTPUT
LCx_ResistorSense: IC5.1(Vs-) R8.1 T3.mb(D) ; port LCx_ResistorSense
LCx_VSENSE: R9.1 R10.2 ; port LCx_VSENSE
NetC2_2: C2.2 IC5.3(FIL)

Not connected (* = marked no-connect by the designer): IC5 6(A2)*

### Channels
U_LOW_CURRENT_OUTPUTS/U_PDC_Low_Current_Outputs: designators end in _U_LOW_CURRENT_OUTPUTS_U_PDC_Low_Current_Outputs#1; ports LCx_GATE=LC1_GATE LCx_ISENSE=LC_1_ISENSE_ADC LCx_OUTPUT=LC_1_OUTPUT LCx_ResistorSense=LC1_OCSense LCx_VSENSE=LC_1_VSENSE_ADC
U_LOW_CURRENT_OUTPUTS/U_PDC_Low_Current_Outputs: designators end in _U_LOW_CURRENT_OUTPUTS_U_PDC_Low_Current_Outputs#2; ports LCx_GATE=LC2_GATE LCx_ISENSE=LC_2_ISENSE_ADC LCx_OUTPUT=LC_2_OUTPUT LCx_ResistorSense=LC2_OCSense LCx_VSENSE=LC_2_VSENSE_ADC
U_LOW_CURRENT_OUTPUTS/U_PDC_Low_Current_Outputs: designators end in _U_LOW_CURRENT_OUTPUTS_U_PDC_Low_Current_Outputs#3; ports LCx_GATE=LC3_GATE LCx_ISENSE=LC_3_ISENSE_ADC LCx_OUTPUT=LC_3_OUTPUT LCx_ResistorSense=LC3_OCSense LCx_VSENSE=LC_3_VSENSE_ADC
U_LOW_CURRENT_OUTPUTS/U_PDC_Low_Current_Outputs: designators end in _U_LOW_CURRENT_OUTPUTS_U_PDC_Low_Current_Outputs#4; ports LCx_GATE=LC4_GATE LCx_ISENSE=LC_4_ISENSE_ADC LCx_OUTPUT=LC_4_OUTPUT LCx_ResistorSense=LC4_OCSense LCx_VSENSE=LC_4_VSENSE_ADC
U_LOW_CURRENT_OUTPUTS/U_PDC_Low_Current_Outputs: designators end in _U_LOW_CURRENT_OUTPUTS_U_PDC_Low_Current_Outputs#5; ports LCx_GATE=LC5_GATE LCx_ISENSE=LC_5_ISENSE_ADC LCx_OUTPUT=LC_5_OUTPUT LCx_ResistorSense=LC5_OCSense LCx_VSENSE=LC_5_VSENSE_ADC
U_LOW_CURRENT_OUTPUTS/U_PDC_Low_Current_Outputs: designators end in _U_LOW_CURRENT_OUTPUTS_U_PDC_Low_Current_Outputs#6; ports LCx_GATE=LC6_GATE LCx_ISENSE=LC_6_ISENSE_ADC LCx_OUTPUT=LC_6_OUTPUT LCx_ResistorSense=LC6_OCSense LCx_VSENSE=LC_6_VSENSE_ADC
U_LOW_CURRENT_OUTPUTS/U_PDC_Low_Current_Outputs: designators end in _U_LOW_CURRENT_OUTPUTS_U_PDC_Low_Current_Outputs#7; ports LCx_GATE=LC7_GATE LCx_ISENSE=LC_7_ISENSE_ADC LCx_OUTPUT=LC_7_OUTPUT LCx_ResistorSense=LC7_OCSense LCx_VSENSE=LC_7_VSENSE_ADC
U_LOW_CURRENT_OUTPUTS/U_PDC_Low_Current_Outputs: designators end in _U_LOW_CURRENT_OUTPUTS_U_PDC_Low_Current_Outputs#8; ports LCx_GATE=LC8_GATE LCx_ISENSE=LC_8_ISENSE_ADC LCx_OUTPUT=LC_8_OUTPUT LCx_ResistorSense=LC8_OCSense LCx_VSENSE=LC_8_VSENSE_ADC

### Library data of the parts
C2 = 57: Manufacturer_id: 1; idCapacitor: 57; Name: Cap_220pf_16V_CAP 0402/1005; Dielectric: Ceramic; Created_By: Nick Mah; Drawer_id: 1; Voltage_Rating: 16V; Package: CAP 0402/1005; Created_Date: 10/20/2018
IC5 = 13: Manufacturer_id: 1; idIC_Misc: 13; Name: LT6100 Current Sense Amp; Created_By: Eddy; Drawer_id: 1; Package: MS8; Created_Date: 10/17/2018
R8 = 2701: Current Sense Resistor; Manufacturer_id: 1; MfrPartNo: CSRN2010FK20L0; idResistor: 2701; Name: Res_.02_2010_1W_1%; Created_By: Angel; Supplier 1: Digi-Key; Supplier Part Number 1: Digi-Key; Drawer_id: 1; Tolerance: 1%; Power: 1W; Package: 2010; Link: https://www.digikey.com/product-detail/en/stackpole-electronics-inc/CSRN2010FK20L0/CSRN2010FK20L0TR-ND/1646098; ComponentLink1Description: Datasheet
R9 = 2430: Manufacturer_id: 1; idResistor: 2430; Name: Res_27k_0805_1/10W_10%; Created_By: Nick Mah; Supplier 1: Digi-Key; Drawer_id: 1; Tolerance: 10%; Power: 1/10W; Package: 0805; ComponentLink1Description: Datasheet; Created_Date: 2018-10-20
R10 = 97: Manufacturer_id: 1; idResistor: 97; Name: Res_10k_0402_1/10W_1%; Created_By: Nick Mah; Supplier 1: Digi-Key; Drawer_id: 1; Tolerance: 1%; Power: 1/10W; Package: 0402; ComponentLink1Description: Datasheet; Created_Date: 2018-10-20
T3 = 3: N-Channel 25V 100A (Tc) 106W (Tc) Surface Mount LFPAK56, Power-SO8; Manufacturer_id: 6; MfrPartNo: PSMN2R2-25YLC,115; idFETs: 3; Drawer_id: 1; Value: N_Channel; Rds_On: 2.5mOhm; Vgs(typ): 10V; Vgs(Max): 20V; Created_By: Nick; Name: PSMN2R2; Vdss: 25V; Num_Circuits: 1; Id: 100A; Package: LFPAK-SO8; Link: https://www.digikey.com/product-detail/en/nexperia-usa-inc/PSMN2R2-25YLC115/1727-5299-1-ND/2674299; ComponentLink1Description: Datasheet; ComponentLink1URL: https://assets.nexperia.com/documents/data-sheet/PSMN2R2-25YLC.pdf; Supplier1: Digi-Key; Supplier1PartNo: 1727-5299-1-ND

## Sheet PDC_Gate_Driver.SchDoc
size A
Used 2 times, as channels U_LOW_CURRENT_OUTPUTS/U_PDC_Gate_Driver, U_LOW_CURRENT_OUTPUTS/U_PDC_Gate_Driver. Parts and nets are listed once, with the designators drawn on the sheet.
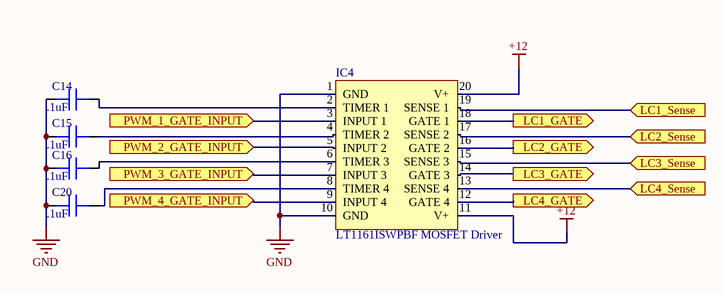
[diagram p4: PDC_Gate_Driver.SchDoc]

### Parts
C14  capacitance: .1uF  [0603]  (hidden comment: capacitor)
C15  capacitance: .1uF  [0603]  (hidden comment: capacitor)
C16  capacitance: .1uF  [0603]  (hidden comment: capacitor)
C20  capacitance: .1uF  [0603]  (hidden comment: capacitor)
IC4  LT1161ISWPBF MOSFET Driver  [SO-20]

### Ports
LC1_GATE (out), LC1_Sense (in), LC2_GATE (out), LC2_Sense (in), LC3_GATE (out), LC3_Sense (in), LC4_GATE (out), LC4_Sense (in), PWM_1_GATE_INPUT (in), PWM_2_GATE_INPUT (in), PWM_3_GATE_INPUT (in), PWM_4_GATE_INPUT (in)

### Nets
+12: IC4.11(V+) IC4.20(V+)
GND: C14.1 C15.1 C16.1 C20.1 IC4.1(GND) IC4.10(GND)
LC1_GATE: IC4.18(GATE_1) ; port LC1_GATE
LC1_Sense: IC4.19(SENSE_1) ; port LC1_Sense
LC2_GATE: IC4.16(GATE_2) ; port LC2_GATE
LC2_Sense: IC4.17(SENSE_2) ; port LC2_Sense
LC3_GATE: IC4.14(GATE_3) ; port LC3_GATE
LC3_Sense: IC4.15(SENSE_3) ; port LC3_Sense
LC4_GATE: IC4.12(GATE_4) ; port LC4_GATE
LC4_Sense: IC4.13(SENSE_4) ; port LC4_Sense
PWM_1_GATE_INPUT: IC4.3(INPUT_1) ; port PWM_1_GATE_INPUT
PWM_2_GATE_INPUT: IC4.5(INPUT_2) ; port PWM_2_GATE_INPUT
PWM_3_GATE_INPUT: IC4.7(INPUT_3) ; port PWM_3_GATE_INPUT
PWM_4_GATE_INPUT: IC4.9(INPUT_4) ; port PWM_4_GATE_INPUT
NetC14_2: C14.2 IC4.2(TIMER_1)
NetC15_2: C15.2 IC4.4(TIMER_2)
NetC16_2: C16.2 IC4.6(TIMER_3)
NetC20_2: C20.2 IC4.8(TIMER_4)

### Channels
U_LOW_CURRENT_OUTPUTS/U_PDC_Gate_Driver: designators end in _U_LOW_CURRENT_OUTPUTS_U_PDC_Gate_Driver#1; ports LC1_GATE=LC1_GATE LC1_Sense=LC1_OCSense LC2_GATE=LC2_GATE LC2_Sense=LC2_OCSense LC3_GATE=LC3_GATE LC3_Sense=LC3_OCSense LC4_GATE=LC4_GATE LC4_Sense=LC4_OCSense PWM_1_GATE_INPUT=LC1_EN PWM_2_GATE_INPUT=LC2_EN PWM_3_GATE_INPUT=LC3_EN PWM_4_GATE_INPUT=LC4_EN
U_LOW_CURRENT_OUTPUTS/U_PDC_Gate_Driver: designators end in _U_LOW_CURRENT_OUTPUTS_U_PDC_Gate_Driver#2; ports LC1_GATE=LC5_GATE LC1_Sense=LC5_OCSense LC2_GATE=LC6_GATE LC2_Sense=LC6_OCSense LC3_GATE=LC7_GATE LC3_Sense=LC7_OCSense LC4_GATE=LC8_GATE LC4_Sense=LC8_OCSense PWM_1_GATE_INPUT=LC5_EN PWM_2_GATE_INPUT=LC6_EN PWM_3_GATE_INPUT=LC7_EN PWM_4_GATE_INPUT=LC8_EN

### Library data of the parts
C14-C16 C20 = 1: Generic 0603 capacitor; id: 1; voltage: 50; dielectric: Ceramic; percent tolerance: 10; name: 0603 Capacitor; ESR: 1; package: 0603; quantity: 0
IC4 = 16: Manufacturer_id: 1; idIC_Misc: 16; Created_By: Eunice Bernardo; Drawer_id: 1; Name: LT1161ISWPBF MOSFET Driver; Created_Date: 10/27/2018

## Sheet E_STOP_&_GATE_DRIVE.SchDoc
size A
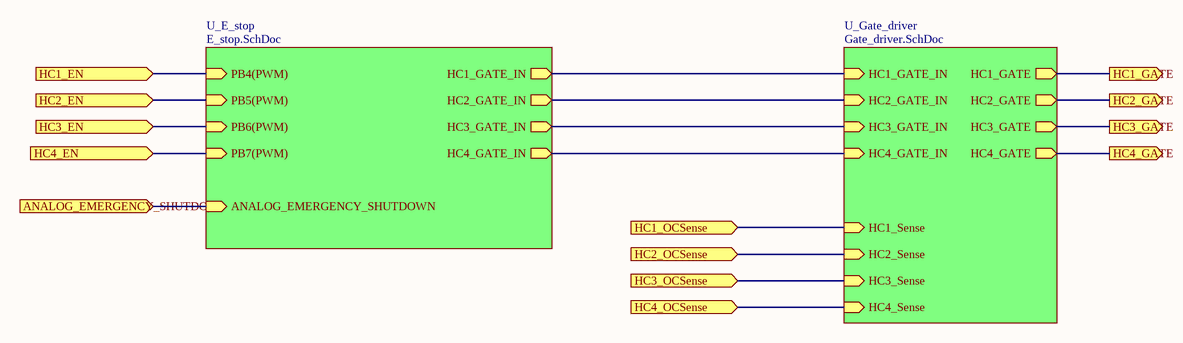
[diagram p5: E_STOP_&_GATE_DRIVE.SchDoc]

### Sub-sheets
U_E_stop = E_stop.SchDoc: HC1_GATE_IN (out), HC2_GATE_IN (out), HC3_GATE_IN (out), HC4_GATE_IN (out), PB4(PWM) (in), PB5(PWM) (in), PB6(PWM) (in), PB7(PWM) (in), ANALOG_EMERGENCY_SHUTDOWN (in)
U_Gate_driver = Gate_driver.SchDoc: HC1_GATE (out), HC2_GATE (out), HC3_GATE (out), HC4_GATE (out), HC1_GATE_IN (in), HC2_GATE_IN (in), HC3_GATE_IN (in), HC4_GATE_IN (in), HC1_Sense (in), HC4_Sense (in), HC2_Sense (in), HC3_Sense (in)

### Ports
ANALOG_EMERGENCY_SHUTDOWN (in), HC1_EN (in), HC1_GATE (out), HC1_OCSense (in), HC2_EN (in), HC2_GATE (out), HC2_OCSense (in), HC3_EN (in), HC3_GATE (out), HC3_OCSense (in), HC4_EN (in), HC4_GATE (out), HC4_OCSense (in)

### Nets
EMERGENCY_SHUTDOWN: port ANALOG_EMERGENCY_SHUTDOWN, sheet U_E_stop/ANALOG_EMERGENCY_SHUTDOWN
HC1_EN: port HC1_EN, sheet U_E_stop/PB4(PWM)
HC1_GATE: port HC1_GATE, sheet U_Gate_driver/HC1_GATE
HC1_OCSense: port HC1_OCSense, sheet U_Gate_driver/HC1_Sense
HC2_EN: port HC2_EN, sheet U_E_stop/PB5(PWM)
HC2_GATE: port HC2_GATE, sheet U_Gate_driver/HC2_GATE
HC2_OCSense: port HC2_OCSense, sheet U_Gate_driver/HC2_Sense
HC3_EN: port HC3_EN, sheet U_E_stop/PB6(PWM)
HC3_GATE: port HC3_GATE, sheet U_Gate_driver/HC3_GATE
HC3_OCSense: port HC3_OCSense, sheet U_Gate_driver/HC3_Sense
HC4_EN: port HC4_EN, sheet U_E_stop/PB7(PWM)
HC4_GATE: port HC4_GATE, sheet U_Gate_driver/HC4_GATE
HC4_OCSense: port HC4_OCSense, sheet U_Gate_driver/HC4_Sense
NetIC2_1: sheet U_Gate_driver/HC1_GATE_IN, sheet U_E_stop/HC1_GATE_IN
NetIC2_3: sheet U_Gate_driver/HC2_GATE_IN, sheet U_E_stop/HC2_GATE_IN
NetIC2_5: sheet U_Gate_driver/HC3_GATE_IN, sheet U_E_stop/HC3_GATE_IN
NetIC2_7: sheet U_Gate_driver/HC4_GATE_IN, sheet U_E_stop/HC4_GATE_IN

## Sheet Gate_driver.SchDoc
size A
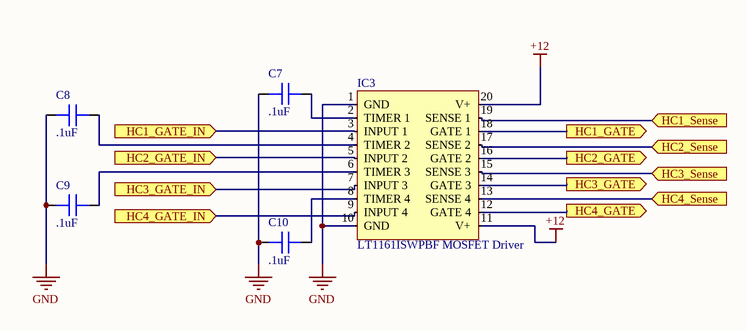
[diagram p6: Gate_driver.SchDoc]

### Parts
C7  capacitance: .1uF  [0603]  (hidden comment: capacitor)
C8  capacitance: .1uF  [0603]  (hidden comment: capacitor)
C9  capacitance: .1uF  [0603]  (hidden comment: capacitor)
C10  capacitance: .1uF  [0603]  (hidden comment: capacitor)
IC3  LT1161ISWPBF MOSFET Driver  [SO-20]

### Ports
HC1_GATE (out), HC1_GATE_IN (in), HC1_Sense (in), HC2_GATE (out), HC2_GATE_IN (in), HC2_Sense (in), HC3_GATE (out), HC3_GATE_IN (in), HC3_Sense (in), HC4_GATE (out), HC4_GATE_IN (in), HC4_Sense (in)

### Nets
+12: IC3.11(V+) IC3.20(V+)
GND: C7.1 C8.1 C9.1 C10.1 IC3.1(GND) IC3.10(GND)  [project net AGND]
HC1_GATE: IC3.18(GATE_1) ; port HC1_GATE
HC1_OCSense: IC3.19(SENSE_1) ; port HC1_Sense
HC2_GATE: IC3.16(GATE_2) ; port HC2_GATE
HC2_OCSense: IC3.17(SENSE_2) ; port HC2_Sense
HC3_GATE: IC3.14(GATE_3) ; port HC3_GATE
HC3_OCSense: IC3.15(SENSE_3) ; port HC3_Sense
HC4_GATE: IC3.12(GATE_4) ; port HC4_GATE
HC4_OCSense: IC3.13(SENSE_4) ; port HC4_Sense
NetC7_2: C7.2 IC3.2(TIMER_1)
NetC8_2: C8.2 IC3.4(TIMER_2)
NetC9_2: C9.2 IC3.6(TIMER_3)
NetC10_2: C10.2 IC3.8(TIMER_4)
NetIC2_1: IC3.3(INPUT_1) ; port HC1_GATE_IN
NetIC2_3: IC3.5(INPUT_2) ; port HC2_GATE_IN
NetIC2_5: IC3.7(INPUT_3) ; port HC3_GATE_IN
NetIC2_7: IC3.9(INPUT_4) ; port HC4_GATE_IN

### Library data of the parts
C7-C10 = 1: as C14 on sheet PDC_Gate_Driver; name: 0603 Capacitor; ESR: 1; package: 0603; quantity: 0
IC3 = 16: as IC4 on sheet PDC_Gate_Driver; Drawer_id: 1; Name: LT1161ISWPBF MOSFET Driver; Created_Date: 10/27/2018

## Sheet E_stop.SchDoc
size A
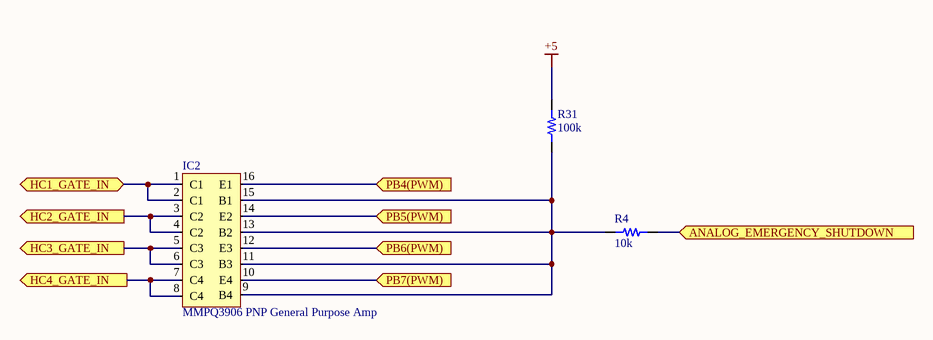
[diagram p7: E_stop.SchDoc]

### Parts
IC2  MMPQ3906 PNP General Purpose Amp  [SOIC-16-NB]
R4  value 10k  [RES 0805/2012]  (hidden comment: Resistor 10k 0805 1/10W 1%)
R31  value 100k  [RES 0805/2012]  (hidden comment: Resistor 100k 0805 1/2W 1%)

### Ports
ANALOG_EMERGENCY_SHUTDOWN (in), HC1_GATE_IN (bidir), HC2_GATE_IN (out), HC3_GATE_IN (out), HC4_GATE_IN (out), PB4(PWM) (in), PB5(PWM) (in), PB6(PWM) (in), PB7(PWM) (in)

### Nets
+5: R31.2
EMERGENCY_SHUTDOWN: R4.2 ; port ANALOG_EMERGENCY_SHUTDOWN
HC1_EN: IC2.16(E1) ; port PB4(PWM)
HC2_EN: IC2.14(E2) ; port PB5(PWM)
HC3_EN: IC2.12(E3) ; port PB6(PWM)
HC4_EN: IC2.10(E4) ; port PB7(PWM)
NetIC2_1: IC2.1(C1) IC2.2(C1) ; port HC1_GATE_IN
NetIC2_3: IC2.3(C2) IC2.4(C2) ; port HC2_GATE_IN
NetIC2_5: IC2.5(C3) IC2.6(C3) ; port HC3_GATE_IN
NetIC2_7: IC2.7(C4) IC2.8(C4) ; port HC4_GATE_IN
NetIC2_9: IC2.9(B4) IC2.11(B3) IC2.13(B2) IC2.15(B1) R4.1 R31.1

### Library data of the parts
IC2 = 20: idIC_Misc: 20
R4 = 529: Manufacturer_id: 1; idResistor: 529; Name: Res_10k_0805_1/10W_1%; Created_By: Nick Mah; Supplier 1: Digi-Key; Drawer_id: 1; Tolerance: 1%; Power: 1/10W; Package: 0805; ComponentLink1Description: Datasheet; Created_Date: 2018-10-20
R31 = 985: Manufacturer_id: 1; idResistor: 985; Name: Res_100k_0805_1/2W_1%; Created_By: Nick Mah; Supplier 1: Digi-Key; Drawer_id: 1; Tolerance: 1%; Power: 1/2W; Package: 0805; ComponentLink1Description: Datasheet; Created_Date: 2018-10-20

## Sheet Reset_Pin.SchDoc
size A
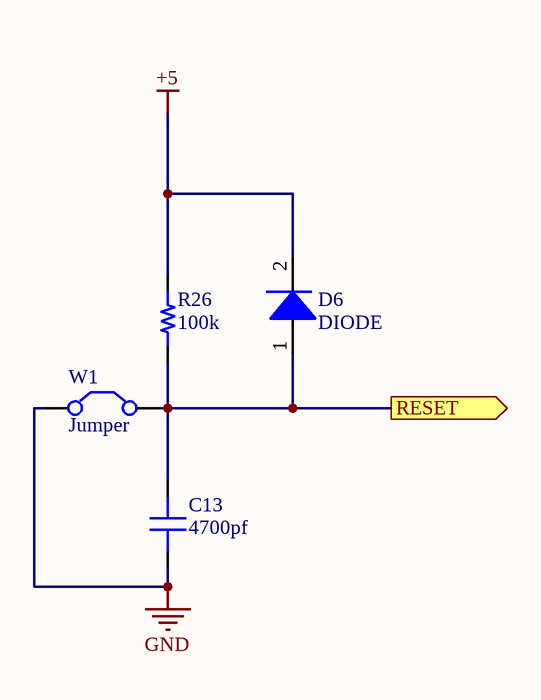
[diagram p8: Reset_Pin.SchDoc]

### Parts
C13  value 4700pf  [CAP 0805/2012]  (hidden comment: Capacitor MLCC 4700pf 25V CAP 0805/2012)
D6  DIODE  [SOD123F]
R26  value 100k  [RES 0805/2012]  (hidden comment: Resistor 100k 0805 1/10W 1%)
W1  Jumper  [XG8T-0231]

### Ports
RESET (out)

### Nets
+5: D6.2(K) R26.2
GND: C13.1 W1.1(C1)  [project net AGND]
RST: C13.2 D6.1(A) R26.1 W1.2(C2) ; port RESET

### Library data of the parts
C13 = 689: Manufacturer_id: 1; idCapacitor: 689; Name: Cap_4700pf_25V_CAP 0805/2012; Dielectric: Ceramic; Created_By: Nick Mah; Drawer_id: 1; Voltage_Rating: 25V; Package: CAP 0805/2012; Created_Date: 10/20/2018
D6 = 4: 100V Reverse DC Voltage; Manufacturer_id: 1; idDiode: 4; Name: 1N4148W-7-F; Ic: 300 mA; Drawer_id: 1; Package: SOD123; MfrPartNo: 1N4148W-7-F; Link: https://www.digikey.com/product-detail/en/diodes-incorporated/1N4148W-7-F/1N4148W-FDICT-ND/815280
R26 = 553: Manufacturer_id: 1; idResistor: 553; Name: Res_100k_0805_1/10W_1%; Created_By: Nick Mah; Supplier 1: Digi-Key; Drawer_id: 1; Tolerance: 1%; Power: 1/10W; Package: 0805; ComponentLink1Description: Datasheet; Created_Date: 2018-10-20
W1 = 18: Jumper headers; Manufacturer_id: 1; idFuse: 3; idConn: 18; Num_Contacts: 2; Pitch: .1 mm; Drawer_id: 1; Name: XG8T-0231; Value: Jumper; Num_Rows: 1; MfrPartNo: XG8T-0231; Link: https://www.digikey.ca/product-detail/en/omron-electronics-inc-emc-div/XG8T-0231/XG8T-0231-ND/1829453; ComponentLink1Description: Datasheet; Supplier1: Digi-Key

## Sheet Temperature_Sensing.SchDoc
size A
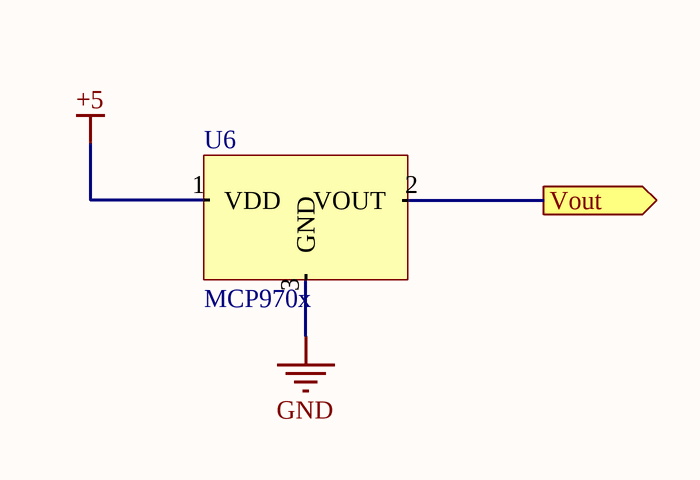
[diagram p9: Temperature_Sensing.SchDoc]

### Parts
U6  MCP970x  [SOT23-3]

### Ports
Vout (out)

### Nets
+5: U6.1(VDD)
GND: U6.3(GND)  [project net AGND]
TEMP_SENSE: U6.2(VOUT) ; port Vout

### Library data of the parts
U6 = 23: Manufacturer_id: 1; MfrPartNo: MCP9701T-E/TT; idFuse: 3; idIC_Misc: 23; Vin(Min): 3.1V; Vin(Max): 5.5V; Drawer_id: 1; Name: MCP970x; Package: SOT23-3; Link: https://www.digikey.com/product-detail/en/microchip-technology/MCP9701T-E-TT/MCP9701T-E-TTCT-ND/1987446

## Sheet RECTIFIER_SHUTDOWN_CCT.SchDoc
size A
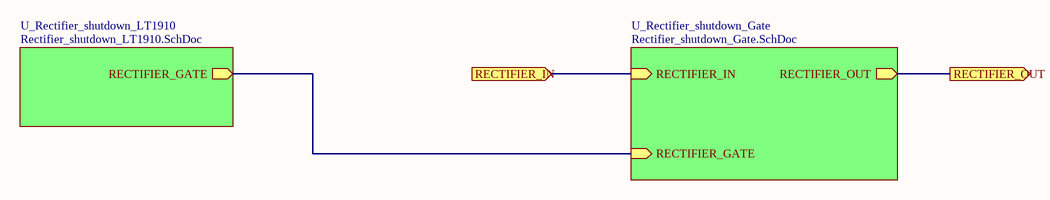
[diagram p10: RECTIFIER_SHUTDOWN_CCT.SchDoc]

### Sub-sheets
U_Rectifier_shutdown_Gate = Rectifier_shutdown_Gate.SchDoc: RECTIFIER_OUT (out), RECTIFIER_IN (in), RECTIFIER_GATE (in)
U_Rectifier_shutdown_LT1910 = Rectifier_shutdown_LT1910.SchDoc: RECTIFIER_GATE (out)

### Ports
RECTIFIER_IN (in), RECTIFIER_OUT (out)

### Nets
RECTIFIER_IN: port RECTIFIER_IN, sheet U_Rectifier_shutdown_Gate/RECTIFIER_IN
RECTIFIER_OUT: port RECTIFIER_OUT, sheet U_Rectifier_shutdown_Gate/RECTIFIER_OUT
NetM1_4: sheet U_Rectifier_shutdown_Gate/RECTIFIER_GATE, sheet U_Rectifier_shutdown_LT1910/RECTIFIER_GATE

## Sheet Rectifier_shutdown_Gate.SchDoc
size A
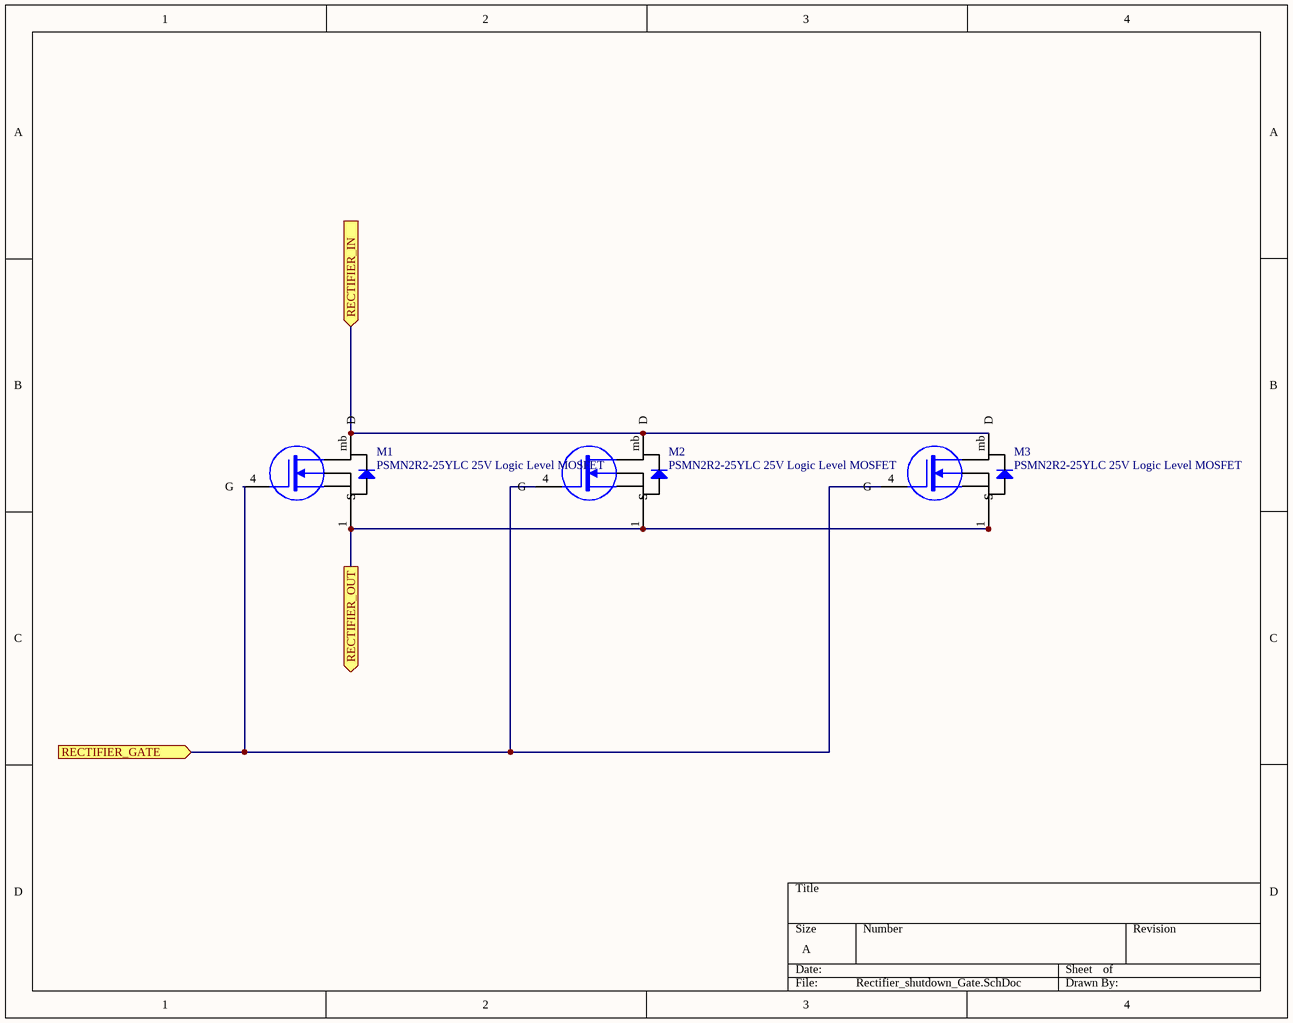
[diagram p11: Rectifier_shutdown_Gate.SchDoc]

### Parts
M1  PSMN2R2-25YLC 25V Logic Level MOSFET  [LFPAK-SO8]
M2  PSMN2R2-25YLC 25V Logic Level MOSFET  [LFPAK-SO8]
M3  PSMN2R2-25YLC 25V Logic Level MOSFET  [LFPAK-SO8]

### Ports
RECTIFIER_GATE (in), RECTIFIER_IN (in), RECTIFIER_OUT (out)

### Nets
RECTIFIER_IN: M1.mb(D) M2.mb(D) M3.mb(D) ; port RECTIFIER_IN
RECTIFIER_OUT: M1.1(S) M1.2(S) M1.3(S) M2.1(S) M2.2(S) M2.3(S) M3.1(S) M3.2(S) M3.3(S) ; port RECTIFIER_OUT
NetM1_4: M1.4(G) M2.4(G) M3.4(G) ; port RECTIFIER_GATE

### Library data of the parts
M1-M3 = 3: as T3 on sheet PDC_Low_Current_Outputs; Name: PSMN2R2; Vdss: 25V; Num_Circuits: 1; Id: 100A; Package: LFPAK-SO8; Link: https://www.digikey.com/product-detail/en/nexperia-usa-inc/PSMN2R2-25YLC115/1727-5299-1-ND/2674299; ComponentLink1Description: Datasheet; ComponentLink1URL: https://assets.nexperia.com/documents/data-sheet/PSMN2R2-25YLC.pdf; Supplier1: Digi-Key; Supplier1PartNo: 1727-5299-1-ND

## Sheet Rectifier_shutdown_LT1910.SchDoc
size A
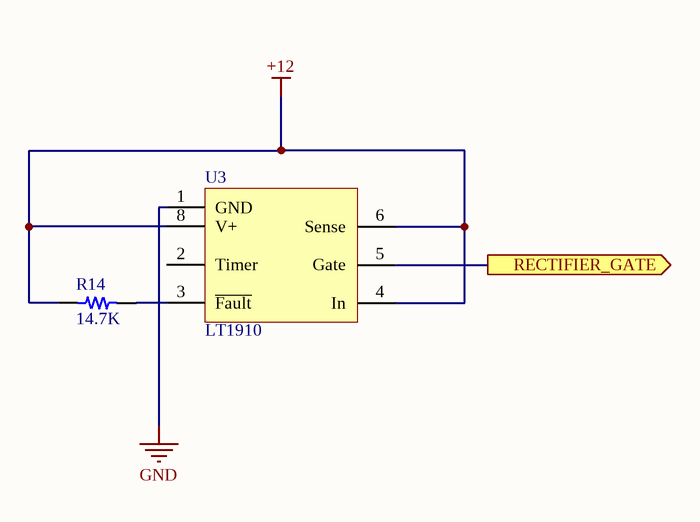
[diagram p12: Rectifier_shutdown_LT1910.SchDoc]

### Parts
R14  value 14.7K  [RES 0805/2012]
U3  LT1910  [SOIC-8]

### Ports
RECTIFIER_GATE (out)

### Nets
+12: R14.1 U3.4(In) U3.6(Sense) U3.8(V+)
GND: U3.1(GND)  [project net AGND]
NetM1_4: U3.5(Gate) ; port RECTIFIER_GATE
NetR14_2: R14.2 U3.3(~{Fault})

Not connected (* = marked no-connect by the designer): U3 2(Timer)

### Library data of the parts
R14 = 2703: Manufacturer_id: 1; idResistor: 2703; Name: Res_14.7K_0805_1/10W_0.5%; Tolerance: 0.5%; Power: 1/10W; Supplier Part Number 1: Digi-Key; Drawer_id: 1; Package: 0805; Link: https://www.digikey.com/product-detail/en/susumu/RR1220P-1472-D-M/RR12P14.7KDCT-ND/1288245; ComponentLink1Description: Datasheet
U3 = 18: Protected High Side MOSFET Driver; Manufacturer_id: 1; idIC_Misc: 18; Name: LT1910 MOSFET Driver; Drawer_id: 1

## Sheet HIGH_CURRENT_OUTPUTS.SchDoc
size A
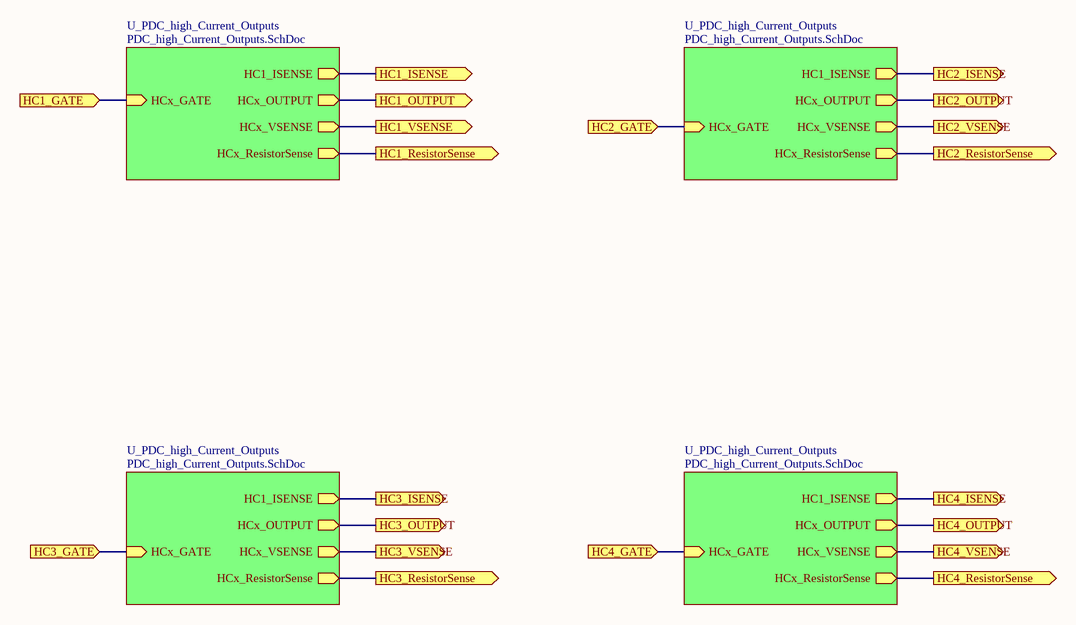
[diagram p13: HIGH_CURRENT_OUTPUTS.SchDoc]

### Sub-sheets
U_PDC_high_Current_Outputs = PDC_high_Current_Outputs.SchDoc: HC1_ISENSE (out), HCx_OUTPUT (out), HCx_VSENSE (out), HCx_GATE (in), HCx_ResistorSense (out)
U_PDC_high_Current_Outputs = PDC_high_Current_Outputs.SchDoc: HC1_ISENSE (out), HCx_OUTPUT (out), HCx_VSENSE (out), HCx_GATE (in), HCx_ResistorSense (out)
U_PDC_high_Current_Outputs = PDC_high_Current_Outputs.SchDoc: HC1_ISENSE (out), HCx_OUTPUT (out), HCx_VSENSE (out), HCx_GATE (in), HCx_ResistorSense (out)
U_PDC_high_Current_Outputs = PDC_high_Current_Outputs.SchDoc: HC1_ISENSE (out), HCx_OUTPUT (out), HCx_VSENSE (out), HCx_GATE (in), HCx_ResistorSense (out)

### Ports
HC1_GATE (in), HC1_ISENSE (out), HC1_OUTPUT (out), HC1_ResistorSense (out), HC1_VSENSE (out), HC2_GATE (in), HC2_ISENSE (out), HC2_OUTPUT (out), HC2_ResistorSense (out), HC2_VSENSE (out), HC3_GATE (in), HC3_ISENSE (out), HC3_OUTPUT (out), HC3_ResistorSense (out), HC3_VSENSE (out), HC4_GATE (in), HC4_ISENSE (out), HC4_OUTPUT (out), HC4_ResistorSense (out), HC4_VSENSE (out)

### Nets
HC1_GATE: port HC1_GATE, sheet U_PDC_high_Current_Outputs/HCx_GATE
HC1_ISENSE_ADC: port HC1_ISENSE, sheet U_PDC_high_Current_Outputs/HC1_ISENSE
HC1_OCSense: port HC1_ResistorSense, sheet U_PDC_high_Current_Outputs/HCx_ResistorSense
HC1_VSENSE_ADC: port HC1_VSENSE, sheet U_PDC_high_Current_Outputs/HCx_VSENSE
HC2_GATE: port HC2_GATE, sheet U_PDC_high_Current_Outputs/HCx_GATE
HC2_ISENSE_ADC: port HC2_ISENSE, sheet U_PDC_high_Current_Outputs/HC1_ISENSE
HC2_OCSense: port HC2_ResistorSense, sheet U_PDC_high_Current_Outputs/HCx_ResistorSense
HC2_VSENSE_ADC: port HC2_VSENSE, sheet U_PDC_high_Current_Outputs/HCx_VSENSE
HC3_GATE: port HC3_GATE, sheet U_PDC_high_Current_Outputs/HCx_GATE
HC3_ISENSE_ADC: port HC3_ISENSE, sheet U_PDC_high_Current_Outputs/HC1_ISENSE
HC3_OCSense: port HC3_ResistorSense, sheet U_PDC_high_Current_Outputs/HCx_ResistorSense
HC3_VSENSE_ADC: port HC3_VSENSE, sheet U_PDC_high_Current_Outputs/HCx_VSENSE
HC4_GATE: port HC4_GATE, sheet U_PDC_high_Current_Outputs/HCx_GATE
HC4_ISENSE_ADC: port HC4_ISENSE, sheet U_PDC_high_Current_Outputs/HC1_ISENSE
HC4_OCSense: port HC4_ResistorSense, sheet U_PDC_high_Current_Outputs/HCx_ResistorSense
HC4_VSENSE_ADC: port HC4_VSENSE, sheet U_PDC_high_Current_Outputs/HCx_VSENSE
HC_1_OUTPUT: port HC1_OUTPUT, sheet U_PDC_high_Current_Outputs/HCx_OUTPUT
HC_2_OUTPUT: port HC2_OUTPUT, sheet U_PDC_high_Current_Outputs/HCx_OUTPUT
HC_3_OUTPUT: port HC3_OUTPUT, sheet U_PDC_high_Current_Outputs/HCx_OUTPUT
HC_4_OUTPUT: port HC4_OUTPUT, sheet U_PDC_high_Current_Outputs/HCx_OUTPUT

## Sheet PDC_high_Current_Outputs.SchDoc
size A
Used 4 times, as channels U_HIGH_CURRENT_OUTPUTS/U_PDC_high_Current_Outputs, U_HIGH_CURRENT_OUTPUTS/U_PDC_high_Current_Outputs, U_HIGH_CURRENT_OUTPUTS/U_PDC_high_Current_Outputs, U_HIGH_CURRENT_OUTPUTS/U_PDC_high_Current_Outputs. Parts and nets are listed once, with the designators drawn on the sheet.
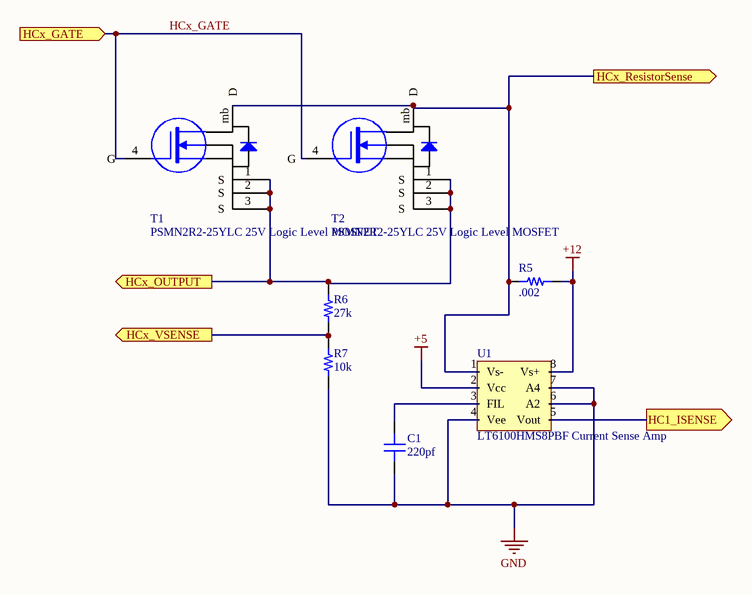
[diagram p14: PDC_high_Current_Outputs.SchDoc]

### Parts
C1  value 220pf  [CAP 0402/1005]  (hidden comment: Capacitor MLCC 220pf 16V CAP 0402/1005)
R5  value .002  [RES 2010/5025]  (hidden comment: Resistor .002 2010 1.5W 1%)
R6  value 27k  [RES 0805/2012]  (hidden comment: Resistor 27k 0805 1/10W 10%)
R7  value 10k  [RES 0402/1005]  (hidden comment: Resistor 10k 0402 1/10W 1%)
T1  PSMN2R2-25YLC 25V Logic Level MOSFET  [LFPAK-SO8]
T2  PSMN2R2-25YLC 25V Logic Level MOSFET  [LFPAK-SO8]
U1  LT6100HMS8PBF Current Sense Amp  [MSOP-8]

### Ports
HC1_ISENSE (out), HCx_GATE (in), HCx_OUTPUT (out), HCx_ResistorSense (out), HCx_VSENSE (out)

### Nets
+5: U1.2(Vcc)
+12: R5.2 U1.8(Vs+)
GND: C1.1 R7.1 U1.4(Vee) U1.6(A2) U1.7(A4)
HC1_ISENSE: U1.5(Vout) ; port HC1_ISENSE
HCx_GATE: T1.4(G) T2.4(G) ; port HCx_GATE
HCx_OUTPUT: R6.2 T1.1(S) T1.2(S) T1.3(S) T2.1(S) T2.2(S) T2.3(S) ; port HCx_OUTPUT
HCx_ResistorSense: R5.1 T1.mb(D) T2.mb(D) U1.1(Vs-) ; port HCx_ResistorSense
HCx_VSENSE: R6.1 R7.2 ; port HCx_VSENSE
NetC1_2: C1.2 U1.3(FIL)

### Channels
U_HIGH_CURRENT_OUTPUTS/U_PDC_high_Current_Outputs: designators end in _U_HIGH_CURRENT_OUTPUTS_U_PDC_high_Current_Outputs#1; ports HC1_ISENSE=HC1_ISENSE_ADC HCx_GATE=HC1_GATE HCx_OUTPUT=HC_1_OUTPUT HCx_ResistorSense=HC1_OCSense HCx_VSENSE=HC1_VSENSE_ADC
U_HIGH_CURRENT_OUTPUTS/U_PDC_high_Current_Outputs: designators end in _U_HIGH_CURRENT_OUTPUTS_U_PDC_high_Current_Outputs#2; ports HC1_ISENSE=HC2_ISENSE_ADC HCx_GATE=HC2_GATE HCx_OUTPUT=HC_2_OUTPUT HCx_ResistorSense=HC2_OCSense HCx_VSENSE=HC2_VSENSE_ADC
U_HIGH_CURRENT_OUTPUTS/U_PDC_high_Current_Outputs: designators end in _U_HIGH_CURRENT_OUTPUTS_U_PDC_high_Current_Outputs#3; ports HC1_ISENSE=HC3_ISENSE_ADC HCx_GATE=HC3_GATE HCx_OUTPUT=HC_3_OUTPUT HCx_ResistorSense=HC3_OCSense HCx_VSENSE=HC3_VSENSE_ADC
U_HIGH_CURRENT_OUTPUTS/U_PDC_high_Current_Outputs: designators end in _U_HIGH_CURRENT_OUTPUTS_U_PDC_high_Current_Outputs#4; ports HC1_ISENSE=HC4_ISENSE_ADC HCx_GATE=HC4_GATE HCx_OUTPUT=HC_4_OUTPUT HCx_ResistorSense=HC4_OCSense HCx_VSENSE=HC4_VSENSE_ADC

### Library data of the parts
C1 = 57: as C2 on sheet PDC_Low_Current_Outputs; Drawer_id: 1; Voltage_Rating: 16V; Package: CAP 0402/1005; Created_Date: 10/20/2018
R5 = 2702: Current Sense Resistor; Manufacturer_id: 1; MfrPartNo: CSNL2010FT2L00; idResistor: 2702; Name: Res_.002_2010_1.5W_1%; Created_By: Angel; Supplier 1: Digi-Key; Supplier Part Number 1: Digi-Key; Drawer_id: 1; Tolerance: 1%; Power: 1.5W; Package: 2010; Link: https://www.digikey.com/product-detail/en/stackpole-electronics-inc/CSNL2010FT2L00/CSNL2010FT2L00CT-ND/1788126; ComponentLink1Description: Datasheet
R6 = 2430: as R9 on sheet PDC_Low_Current_Outputs; Supplier 1: Digi-Key; Drawer_id: 1; Tolerance: 10%; Power: 1/10W; Package: 0805; ComponentLink1Description: Datasheet; Created_Date: 2018-10-20
R7 = 97: as R10 on sheet PDC_Low_Current_Outputs; Supplier 1: Digi-Key; Drawer_id: 1; Tolerance: 1%; Power: 1/10W; Package: 0402; ComponentLink1Description: Datasheet; Created_Date: 2018-10-20
T1 T2 = 3: as T3 on sheet PDC_Low_Current_Outputs; Name: PSMN2R2; Vdss: 25V; Num_Circuits: 1; Id: 100A; Package: LFPAK-SO8; Link: https://www.digikey.com/product-detail/en/nexperia-usa-inc/PSMN2R2-25YLC115/1727-5299-1-ND/2674299; ComponentLink1Description: Datasheet; ComponentLink1URL: https://assets.nexperia.com/documents/data-sheet/PSMN2R2-25YLC.pdf; Supplier1: Digi-Key; Supplier1PartNo: 1727-5299-1-ND
U1 = 13: as IC5 on sheet PDC_Low_Current_Outputs; Drawer_id: 1; Package: MS8; Created_Date: 10/17/2018

## Sheet ANALOG_HC_OVERCURRENT_REDUNDANCY_CCT.SchDoc
size A
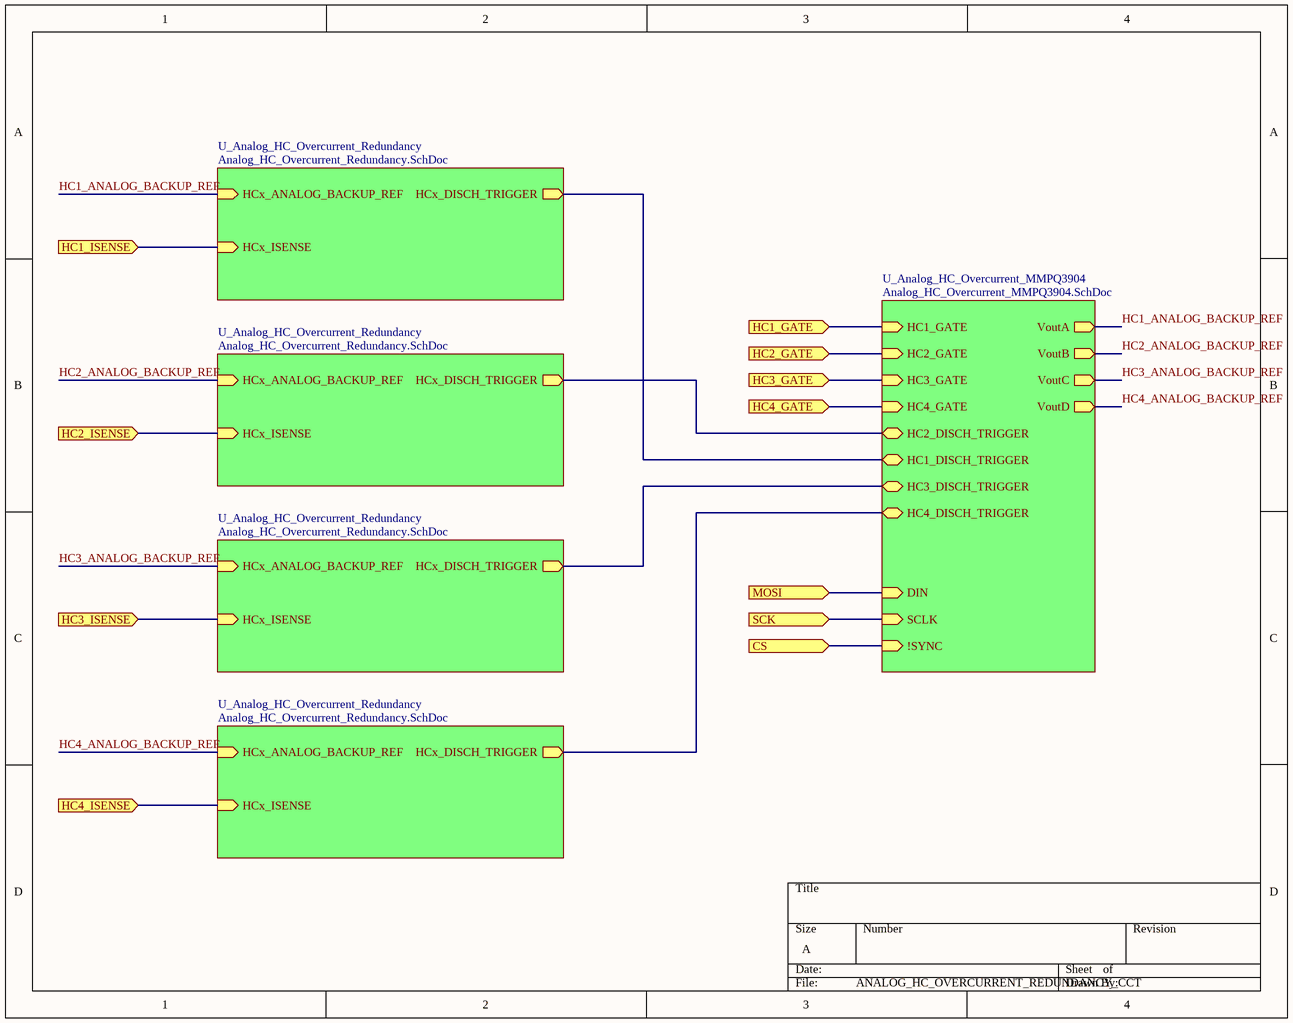
[diagram p15: ANALOG_HC_OVERCURRENT_REDUNDANCY_CCT.SchDoc]

### Sub-sheets
U_Analog_HC_Overcurrent_MMPQ3904 = Analog_HC_Overcurrent_MMPQ3904.SchDoc: HC1_GATE (in), HC2_GATE (in), HC3_GATE (in), HC4_GATE (in), HC2_DISCH_TRIGGER (bidir), HC1_DISCH_TRIGGER (bidir), HC3_DISCH_TRIGGER (bidir), HC4_DISCH_TRIGGER (bidir), VoutA (out), VoutB (out), VoutC (out), VoutD (out), DIN (in), SCLK (in), !SYNC (in)
U_Analog_HC_Overcurrent_Redundancy = Analog_HC_Overcurrent_Redundancy.SchDoc: HCx_DISCH_TRIGGER (out), HCx_ANALOG_BACKUP_REF (in), HCx_ISENSE (in)
U_Analog_HC_Overcurrent_Redundancy = Analog_HC_Overcurrent_Redundancy.SchDoc: HCx_DISCH_TRIGGER (out), HCx_ANALOG_BACKUP_REF (in), HCx_ISENSE (in)
U_Analog_HC_Overcurrent_Redundancy = Analog_HC_Overcurrent_Redundancy.SchDoc: HCx_DISCH_TRIGGER (out), HCx_ANALOG_BACKUP_REF (in), HCx_ISENSE (in)
U_Analog_HC_Overcurrent_Redundancy = Analog_HC_Overcurrent_Redundancy.SchDoc: HCx_DISCH_TRIGGER (out), HCx_ANALOG_BACKUP_REF (in), HCx_ISENSE (in)

### Ports
CS (in), HC1_GATE (in), HC1_ISENSE (in), HC2_GATE (in), HC2_ISENSE (in), HC3_GATE (in), HC3_ISENSE (in), HC4_GATE (in), HC4_ISENSE (in), MOSI (in), SCK (in)

### Nets
CS: port CS, sheet U_Analog_HC_Overcurrent_MMPQ3904/!SYNC
HC1_ANALOG_BACKUP_REF: sheet U_Analog_HC_Overcurrent_Redundancy/HCx_ANALOG_BACKUP_REF, sheet U_Analog_HC_Overcurrent_MMPQ3904/VoutA
HC1_EN: port HC1_GATE, sheet U_Analog_HC_Overcurrent_MMPQ3904/HC1_GATE
HC1_ISENSE_ADC: port HC1_ISENSE, sheet U_Analog_HC_Overcurrent_Redundancy/HCx_ISENSE
HC2_ANALOG_BACKUP_REF: sheet U_Analog_HC_Overcurrent_Redundancy/HCx_ANALOG_BACKUP_REF, sheet U_Analog_HC_Overcurrent_MMPQ3904/VoutB
HC2_EN: port HC2_GATE, sheet U_Analog_HC_Overcurrent_MMPQ3904/HC2_GATE
HC2_ISENSE_ADC: port HC2_ISENSE, sheet U_Analog_HC_Overcurrent_Redundancy/HCx_ISENSE
HC3_ANALOG_BACKUP_REF: sheet U_Analog_HC_Overcurrent_Redundancy/HCx_ANALOG_BACKUP_REF, sheet U_Analog_HC_Overcurrent_MMPQ3904/VoutC
HC3_EN: port HC3_GATE, sheet U_Analog_HC_Overcurrent_MMPQ3904/HC3_GATE
HC3_ISENSE_ADC: port HC3_ISENSE, sheet U_Analog_HC_Overcurrent_Redundancy/HCx_ISENSE
HC4_ANALOG_BACKUP_REF: sheet U_Analog_HC_Overcurrent_Redundancy/HCx_ANALOG_BACKUP_REF, sheet U_Analog_HC_Overcurrent_MMPQ3904/VoutD
HC4_EN: port HC4_GATE, sheet U_Analog_HC_Overcurrent_MMPQ3904/HC4_GATE
HC4_ISENSE_ADC: port HC4_ISENSE, sheet U_Analog_HC_Overcurrent_Redundancy/HCx_ISENSE
MOSI: port MOSI, sheet U_Analog_HC_Overcurrent_MMPQ3904/DIN
SCK: port SCK, sheet U_Analog_HC_Overcurrent_MMPQ3904/SCLK
NetQ1_9: sheet U_Analog_HC_Overcurrent_Redundancy/HCx_DISCH_TRIGGER, sheet U_Analog_HC_Overcurrent_MMPQ3904/HC4_DISCH_TRIGGER
NetQ1_11: sheet U_Analog_HC_Overcurrent_Redundancy/HCx_DISCH_TRIGGER, sheet U_Analog_HC_Overcurrent_MMPQ3904/HC3_DISCH_TRIGGER
NetQ1_13: sheet U_Analog_HC_Overcurrent_Redundancy/HCx_DISCH_TRIGGER, sheet U_Analog_HC_Overcurrent_MMPQ3904/HC2_DISCH_TRIGGER
NetQ1_15: sheet U_Analog_HC_Overcurrent_Redundancy/HCx_DISCH_TRIGGER, sheet U_Analog_HC_Overcurrent_MMPQ3904/HC1_DISCH_TRIGGER